# Altium project AutomotiveNetworkEVB.PrjPCB
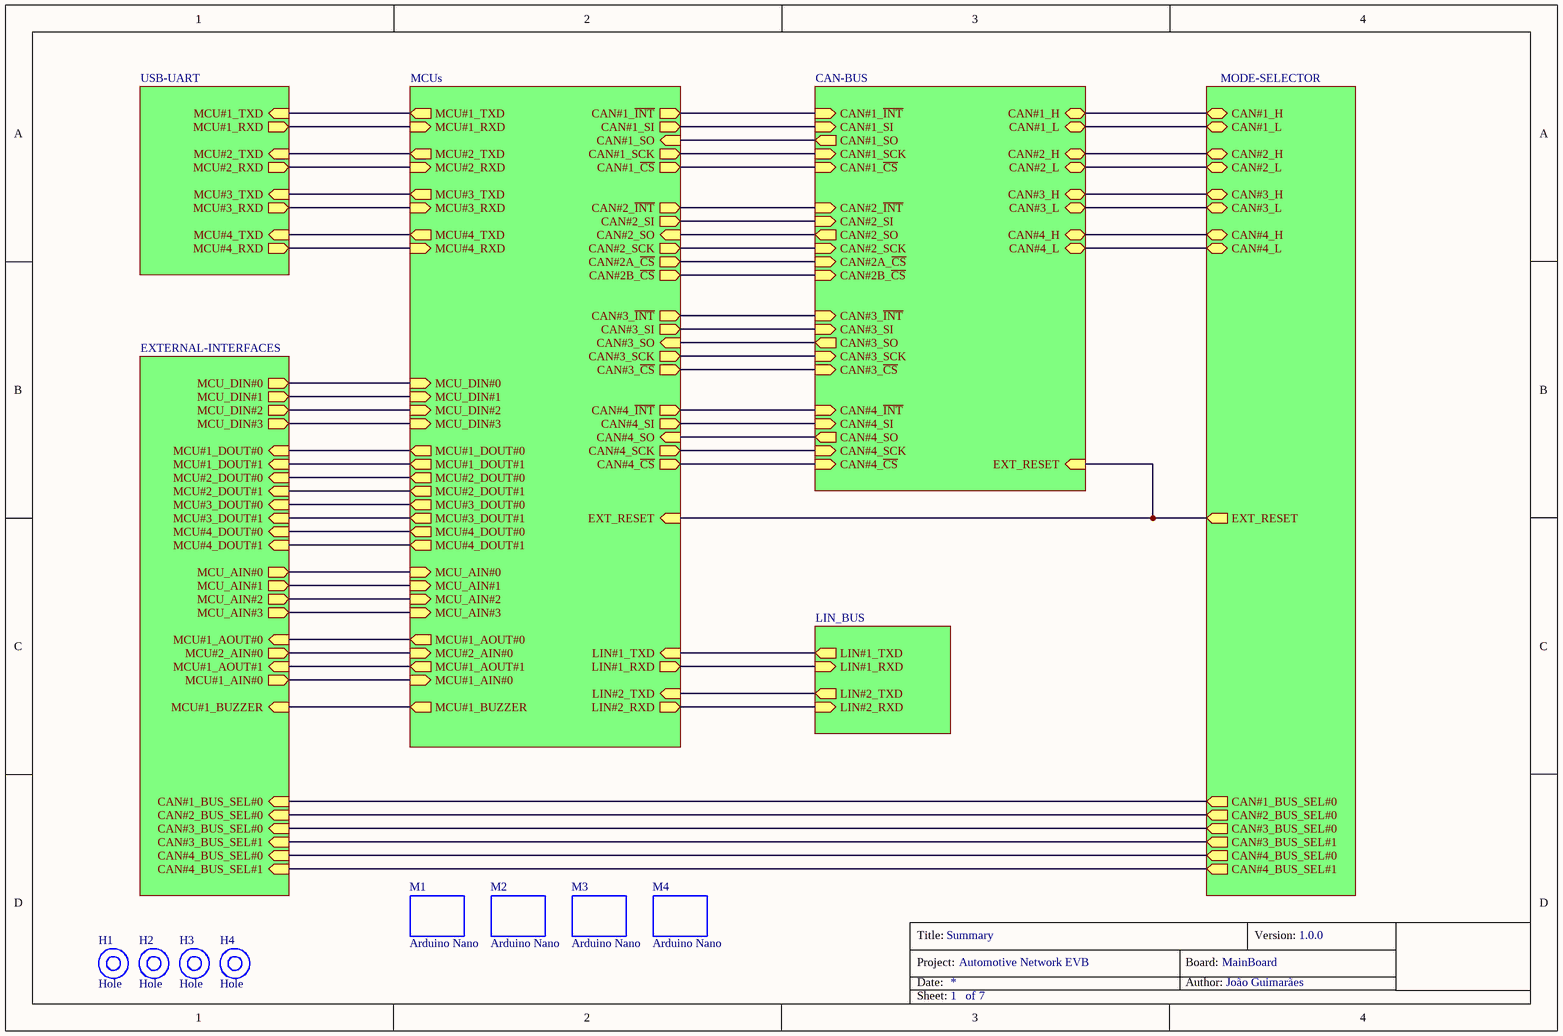
[diagram p0: SUMMARY.SchDoc]
PCB: MainBoard; Project: Automotive Network EVB; ProjectAbrev: ANEVB; Version: 1.0.0
7 sheets, 307 parts. Net scope: hierarchical (ports join the sheet entries above them; power ports are global).
Board file: AutomotiveNetworkEVB.PcbDoc
Sheets:
  SUMMARY.SchDoc
    MCUs = MCUs.SchDoc
    USB-UART = USB-UART.SchDoc
    CAN-BUS = CAN-BUS.SchDoc
    LIN_BUS = LIN-BUS.SchDoc
    EXTERNAL-INTERFACES = EXTERNAL-INTERFACES.SchDoc
    MODE-SELECTOR = MODE-SELECTOR.SchDoc

## Sheet SUMMARY.SchDoc: Summary
size A4; Author: João Guimarães; Revision: 1.0; SheetNumber: 1; SheetTotal: 7; Project: Automotive Network EVB; PCB: MainBoard; Version: 1.0.0

### Parts
H1  Hole  [MISC-HOLE-3.5MM/6.6MM]
H2  Hole  [MISC-HOLE-3.5MM/6.6MM]
H3  Hole  [MISC-HOLE-3.5MM/6.6MM]
H4  Hole  [MISC-HOLE-3.5MM/6.6MM]
M1  Arduino Nano  [MEC-Arduino-Nano]
M2  Arduino Nano  [MEC-Arduino-Nano]
M3  Arduino Nano  [MEC-Arduino-Nano]
M4  Arduino Nano  [MEC-Arduino-Nano]

### Sub-sheets
CAN-BUS = CAN-BUS.SchDoc: CAN#1_~{INT} (in), CAN#1_SI (in), CAN#1_SO (out), CAN#1_SCK (in), CAN#2_~{INT} (in), CAN#2_SI (in), CAN#2_SO (out), CAN#2_SCK (in), CAN#3_~{INT} (in), CAN#2A_~{CS} (in), CAN#2B_~{CS} (in), CAN#3_SI (in), CAN#3_SO (out), CAN#3_SCK (in), CAN#3_~{CS} (in), CAN#4_~{INT} (in), CAN#4_SI (in), CAN#4_SO (out), CAN#4_SCK (in), CAN#4_~{CS} (in), CAN#1_H (bidir), CAN#1_L (bidir), CAN#2_H (bidir), CAN#2_L (bidir), CAN#3_H (bidir), CAN#3_L (bidir), CAN#4_H (bidir), CAN#4_L (bidir), EXT_RESET (in), CAN#1_~{CS} (in)
EXTERNAL-INTERFACES = EXTERNAL-INTERFACES.SchDoc: MCU_DIN#0 (out), MCU#1_DOUT#0 (in), MCU_AIN#0 (out), MCU_DIN#1 (out), MCU_DIN#2 (out), MCU_DIN#3 (out), MCU_AIN#1 (out), MCU_AIN#2 (out), MCU_AIN#3 (out), MCU#1_AOUT#0 (in), MCU#2_AIN#0 (out), MCU#1_AOUT#1 (in), MCU#1_BUZZER (in), MCU#1_DOUT#1 (in), MCU#2_DOUT#0 (in), MCU#2_DOUT#1 (in), MCU#3_DOUT#0 (in), MCU#3_DOUT#1 (in), MCU#4_DOUT#0 (in), MCU#4_DOUT#1 (in), CAN#4_BUS_SEL#1 (in), CAN#4_BUS_SEL#0 (in), CAN#3_BUS_SEL#1 (in), CAN#3_BUS_SEL#0 (in), CAN#2_BUS_SEL#0 (in), CAN#1_BUS_SEL#0 (in), MCU#1_AIN#0 (out)
LIN_BUS = LIN-BUS.SchDoc: LIN#1_TXD (out), LIN#1_RXD (in), LIN#2_TXD (out), LIN#2_RXD (in)
MCUs = MCUs.SchDoc: CAN#1_~{INT} (out), CAN#1_~{CS} (out), CAN#1_SI (out), CAN#1_SO (in), CAN#1_SCK (out), CAN#2_~{INT} (out), CAN#2A_~{CS} (out), CAN#2_SI (out), CAN#2_SO (in), CAN#2_SCK (out), CAN#3_~{INT} (out), CAN#3_~{CS} (out), CAN#3_SI (out), CAN#3_SO (in), CAN#3_SCK (out), CAN#4_~{INT} (out), CAN#4_~{CS} (out), CAN#4_SI (out), CAN#4_SO (in), CAN#4_SCK (out), CAN#2B_~{CS} (out), MCU#1_TXD (out), MCU#1_RXD (in), MCU#2_TXD (out), MCU#3_TXD (out), MCU#4_TXD (out), MCU#2_RXD (in), MCU#3_RXD (in), MCU#4_RXD (in), MCU_DIN#0 (in), MCU_DIN#1 (in), MCU_DIN#2 (in), MCU_DIN#3 (in), LIN#1_TXD (in), LIN#1_RXD (out), LIN#2_TXD (in), LIN#2_RXD (out), MCU#1_DOUT#0 (out), MCU#1_DOUT#1 (out), MCU#2_DOUT#0 (out), MCU#2_DOUT#1 (out), MCU#3_DOUT#0 (out), MCU#3_DOUT#1 (out), MCU#4_DOUT#0 (out), MCU#4_DOUT#1 (out), MCU_AIN#0 (in), MCU_AIN#1 (in), MCU_AIN#2 (in), MCU_AIN#3 (in), MCU#1_AOUT#0 (out), MCU#2_AIN#0 (in), MCU#1_AOUT#1 (out), MCU#1_AIN#0 (in), MCU#1_BUZZER (out), EXT_RESET (in)
MODE-SELECTOR = MODE-SELECTOR.SchDoc: CAN#1_H (bidir), CAN#1_L (bidir), CAN#2_H (bidir), CAN#2_L (bidir), CAN#3_H (bidir), CAN#3_L (bidir), CAN#4_H (bidir), CAN#4_L (bidir), CAN#4_BUS_SEL#1 (out), CAN#4_BUS_SEL#0 (out), CAN#3_BUS_SEL#1 (out), CAN#3_BUS_SEL#0 (out), CAN#2_BUS_SEL#0 (out), CAN#1_BUS_SEL#0 (out), EXT_RESET (out)
USB-UART = USB-UART.SchDoc: MCU#1_TXD (in), MCU#1_RXD (out), MCU#2_TXD (in), MCU#2_RXD (out), MCU#3_TXD (in), MCU#3_RXD (out), MCU#4_TXD (in), MCU#4_RXD (out)

### Nets
CAN#1_H: sheet CAN-BUS/CAN#1_H, sheet MODE-SELECTOR/CAN#1_H
CAN#1_L: sheet CAN-BUS/CAN#1_L, sheet MODE-SELECTOR/CAN#1_L
CAN#2_H: sheet CAN-BUS/CAN#2_H, sheet MODE-SELECTOR/CAN#2_H
CAN#2_~{INT}: sheet MCUs/CAN#2_~{INT}, sheet CAN-BUS/CAN#2_~{INT}
CAN#2_L: sheet CAN-BUS/CAN#2_L, sheet MODE-SELECTOR/CAN#2_L
CAN#2_SCK: sheet MCUs/CAN#2_SCK, sheet CAN-BUS/CAN#2_SCK
CAN#2_SI: sheet MCUs/CAN#2_SI, sheet CAN-BUS/CAN#2_SI
CAN#2_SO: sheet MCUs/CAN#2_SO, sheet CAN-BUS/CAN#2_SO
CAN#3_H: sheet CAN-BUS/CAN#3_H, sheet MODE-SELECTOR/CAN#3_H
CAN#3_L: sheet CAN-BUS/CAN#3_L, sheet MODE-SELECTOR/CAN#3_L
CAN#4_H: sheet CAN-BUS/CAN#4_H, sheet MODE-SELECTOR/CAN#4_H
CAN#4_L: sheet CAN-BUS/CAN#4_L, sheet MODE-SELECTOR/CAN#4_L
EXT_RESET: sheet MCUs/EXT_RESET, sheet CAN-BUS/EXT_RESET, sheet MODE-SELECTOR/EXT_RESET
MCU_AIN#0: sheet MCUs/MCU_AIN#0, sheet EXTERNAL-INTERFACES/MCU_AIN#0
MCU_AIN#1: sheet MCUs/MCU_AIN#1, sheet EXTERNAL-INTERFACES/MCU_AIN#1
MCU_AIN#2: sheet MCUs/MCU_AIN#2, sheet EXTERNAL-INTERFACES/MCU_AIN#2
MCU_AIN#3: sheet MCUs/MCU_AIN#3, sheet EXTERNAL-INTERFACES/MCU_AIN#3
MCU_DIN#0: sheet MCUs/MCU_DIN#0, sheet EXTERNAL-INTERFACES/MCU_DIN#0
MCU_DIN#1: sheet MCUs/MCU_DIN#1, sheet EXTERNAL-INTERFACES/MCU_DIN#1
MCU_DIN#2: sheet MCUs/MCU_DIN#2, sheet EXTERNAL-INTERFACES/MCU_DIN#2
MCU_DIN#3: sheet MCUs/MCU_DIN#3, sheet EXTERNAL-INTERFACES/MCU_DIN#3
NetC23_1: sheet MCUs/MCU#2_AIN#0, sheet EXTERNAL-INTERFACES/MCU#2_AIN#0
NetCON3_1: sheet MCUs/MCU#1_TXD, sheet USB-UART/MCU#1_TXD
NetCON3_2: sheet MCUs/MCU#1_RXD, sheet USB-UART/MCU#1_RXD
NetCON3_5: sheet MCUs/CAN#1_~{INT}, sheet CAN-BUS/CAN#1_~{INT}
NetCON3_6: sheet MCUs/MCU#1_DOUT#0, sheet EXTERNAL-INTERFACES/MCU#1_DOUT#0
NetCON3_7: sheet MCUs/MCU#1_DOUT#1, sheet EXTERNAL-INTERFACES/MCU#1_DOUT#1
NetCON3_8: sheet MCUs/MCU#1_AOUT#0, sheet EXTERNAL-INTERFACES/MCU#1_AOUT#0
NetCON3_9: sheet MCUs/MCU#1_AOUT#1, sheet EXTERNAL-INTERFACES/MCU#1_AOUT#1
NetCON3_10: sheet MCUs/MCU#1_BUZZER, sheet EXTERNAL-INTERFACES/MCU#1_BUZZER
NetCON3_13: sheet MCUs/CAN#1_~{CS}, sheet CAN-BUS/CAN#1_~{CS}
NetCON3_14: sheet MCUs/CAN#1_SI, sheet CAN-BUS/CAN#1_SI
NetCON3_15: sheet MCUs/CAN#1_SO, sheet CAN-BUS/CAN#1_SO
NetCON3_16: sheet MCUs/CAN#1_SCK, sheet CAN-BUS/CAN#1_SCK
NetCON3_25: sheet MCUs/MCU#1_AIN#0, sheet EXTERNAL-INTERFACES/MCU#1_AIN#0
NetCON4_1: sheet MCUs/MCU#2_TXD, sheet USB-UART/MCU#2_TXD
NetCON4_2: sheet MCUs/MCU#2_RXD, sheet USB-UART/MCU#2_RXD
NetCON4_6: sheet MCUs/MCU#2_DOUT#0, sheet EXTERNAL-INTERFACES/MCU#2_DOUT#0
NetCON4_7: sheet MCUs/MCU#2_DOUT#1, sheet EXTERNAL-INTERFACES/MCU#2_DOUT#1
NetCON4_9: sheet MCUs/CAN#2B_~{CS}, sheet CAN-BUS/CAN#2B_~{CS}
NetCON4_13: sheet MCUs/CAN#2A_~{CS}, sheet CAN-BUS/CAN#2A_~{CS}
NetCON5_1: sheet MCUs/MCU#3_TXD, sheet USB-UART/MCU#3_TXD
NetCON5_2: sheet MCUs/MCU#3_RXD, sheet USB-UART/MCU#3_RXD
NetCON5_5: sheet MCUs/CAN#3_~{INT}, sheet CAN-BUS/CAN#3_~{INT}
NetCON5_6: sheet MCUs/MCU#3_DOUT#0, sheet EXTERNAL-INTERFACES/MCU#3_DOUT#0
NetCON5_7: sheet MCUs/MCU#3_DOUT#1, sheet EXTERNAL-INTERFACES/MCU#3_DOUT#1
NetCON5_8: sheet MCUs/LIN#1_TXD, sheet LIN_BUS/LIN#1_TXD
NetCON5_9: sheet MCUs/LIN#1_RXD, sheet LIN_BUS/LIN#1_RXD
NetCON5_13: sheet MCUs/CAN#3_~{CS}, sheet CAN-BUS/CAN#3_~{CS}
NetCON5_14: sheet MCUs/CAN#3_SI, sheet CAN-BUS/CAN#3_SI
NetCON5_15: sheet MCUs/CAN#3_SO, sheet CAN-BUS/CAN#3_SO
NetCON5_16: sheet MCUs/CAN#3_SCK, sheet CAN-BUS/CAN#3_SCK
NetCON6_1: sheet MCUs/MCU#4_TXD, sheet USB-UART/MCU#4_TXD
NetCON6_2: sheet MCUs/MCU#4_RXD, sheet USB-UART/MCU#4_RXD
NetCON6_5: sheet MCUs/CAN#4_~{INT}, sheet CAN-BUS/CAN#4_~{INT}
NetCON6_6: sheet MCUs/MCU#4_DOUT#0, sheet EXTERNAL-INTERFACES/MCU#4_DOUT#0
NetCON6_7: sheet MCUs/MCU#4_DOUT#1, sheet EXTERNAL-INTERFACES/MCU#4_DOUT#1
NetCON6_8: sheet MCUs/LIN#2_TXD, sheet LIN_BUS/LIN#2_TXD
NetCON6_9: sheet MCUs/LIN#2_RXD, sheet LIN_BUS/LIN#2_RXD
NetCON6_13: sheet MCUs/CAN#4_~{CS}, sheet CAN-BUS/CAN#4_~{CS}
NetCON6_14: sheet MCUs/CAN#4_SI, sheet CAN-BUS/CAN#4_SI
NetCON6_15: sheet MCUs/CAN#4_SO, sheet CAN-BUS/CAN#4_SO
NetCON6_16: sheet MCUs/CAN#4_SCK, sheet CAN-BUS/CAN#4_SCK
NetQ1_1: sheet EXTERNAL-INTERFACES/CAN#2_BUS_SEL#0, sheet MODE-SELECTOR/CAN#2_BUS_SEL#0
NetQ2_1: sheet EXTERNAL-INTERFACES/CAN#1_BUS_SEL#0, sheet MODE-SELECTOR/CAN#1_BUS_SEL#0
NetQ12_1: sheet EXTERNAL-INTERFACES/CAN#3_BUS_SEL#0, sheet MODE-SELECTOR/CAN#3_BUS_SEL#0
NetQ13_1: sheet EXTERNAL-INTERFACES/CAN#3_BUS_SEL#1, sheet MODE-SELECTOR/CAN#3_BUS_SEL#1
NetQ14_1: sheet EXTERNAL-INTERFACES/CAN#4_BUS_SEL#0, sheet MODE-SELECTOR/CAN#4_BUS_SEL#0
NetQ15_1: sheet EXTERNAL-INTERFACES/CAN#4_BUS_SEL#1, sheet MODE-SELECTOR/CAN#4_BUS_SEL#1

### Notes on the sheet
- Title:
- Project:
- Date:
- Author:
- Board:
- Version:
- Sheet:
- of

### Library data of the parts
M1-M4 = Arduino Nano Mechanical

## Sheet MCUs.SchDoc: MCUs
size A4; Author: João Guimarães; Organization: Altium Limited; Address1: L3, 12a Rodborough Rd; Address2: Frenchs Forest; Address3: NSW; Address4: Australia 2086; SheetNumber: 3; SheetTotal: 7; Version: 1.0.0; Project: Automotive Network EVB; PCB: MainBoard
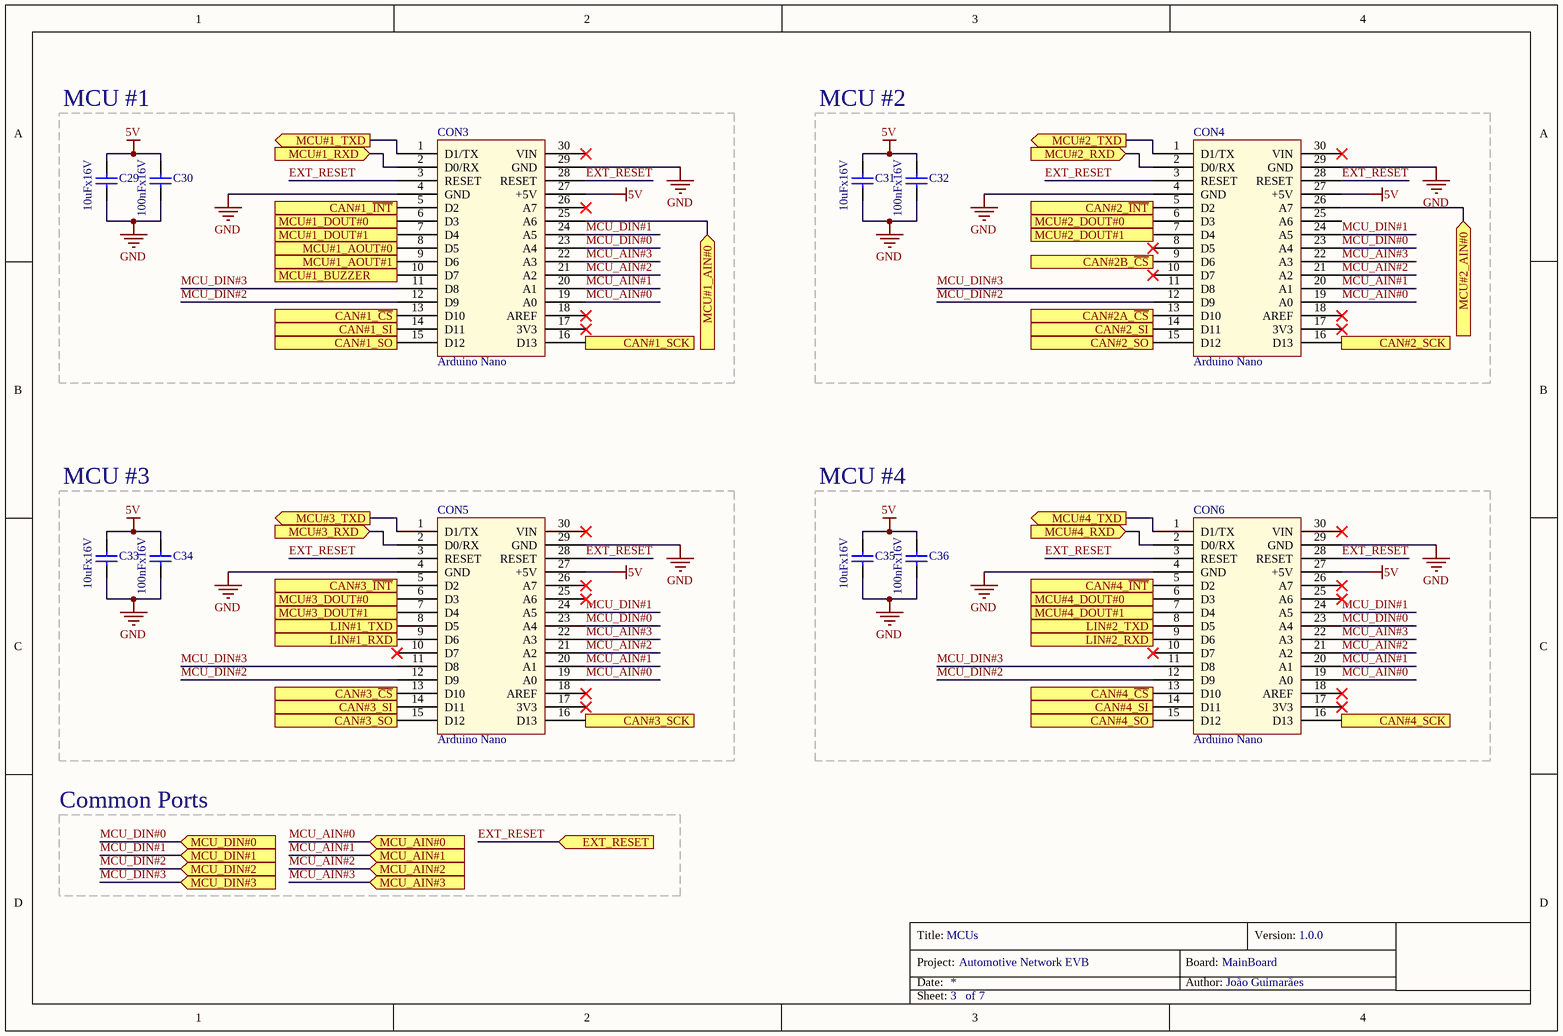
[diagram p1: MCUs.SchDoc]

### Parts
C29  10uFx16V  [DISC-0805]
C30  100nFx16V  [DISC-0603]
C31  10uFx16V  [DISC-0805]
C32  100nFx16V  [DISC-0603]
C33  10uFx16V  [DISC-0805]
C34  100nFx16V  [DISC-0603]
C35  10uFx16V  [DISC-0805]
C36  100nFx16V  [DISC-0603]
CON3  Arduino Nano  [MOD-ARDUINO-NANO]
CON4  Arduino Nano  [MOD-ARDUINO-NANO]
CON5  Arduino Nano  [MOD-ARDUINO-NANO]
CON6  Arduino Nano  [MOD-ARDUINO-NANO]

### Blocks framed on the sheet
MCU #1: C29 C30 CON3
MCU #2: C31 C32 CON4
MCU #3: C33 C34 CON5
MCU #4: C35 C36 CON6

### Ports
CAN#1_SCK (out), CAN#1_SI (out), CAN#1_SO (in), CAN#1_~{CS} (out), CAN#1_~{INT} (out), CAN#2_SCK (out), CAN#2_SI (out), CAN#2_SO (in), CAN#2_~{INT} (out), CAN#2A_~{CS} (out), CAN#2B_~{CS} (out), CAN#3_SCK (out), CAN#3_SI (out), CAN#3_SO (in), CAN#3_~{CS} (out), CAN#3_~{INT} (out), CAN#4_SCK (out), CAN#4_SI (out), CAN#4_SO (in), CAN#4_~{CS} (out), CAN#4_~{INT} (out), EXT_RESET (in), LIN#1_RXD (out), LIN#1_TXD (in), LIN#2_RXD (out), LIN#2_TXD (in), MCU#1_AIN#0 (in), MCU#1_AOUT#0 (out), MCU#1_AOUT#1 (out), MCU#1_BUZZER (out), MCU#1_DOUT#0 (out), MCU#1_DOUT#1 (out), MCU#1_RXD (in), MCU#1_TXD (out), MCU#2_AIN#0 (in), MCU#2_DOUT#0 (out), MCU#2_DOUT#1 (out), MCU#2_RXD (in), MCU#2_TXD (out), MCU#3_DOUT#0 (out), MCU#3_DOUT#1 (out), MCU#3_RXD (in), MCU#3_TXD (out), MCU#4_DOUT#0 (out), MCU#4_DOUT#1 (out), MCU#4_RXD (in), MCU#4_TXD (out), MCU_AIN#0 (in), MCU_AIN#1 (in), MCU_AIN#2 (in), MCU_AIN#3 (in), MCU_DIN#0 (in), MCU_DIN#1 (in), MCU_DIN#2 (in), MCU_DIN#3 (in)

### Nets
5V: C29.1 C30.1 C31.1 C32.1 C33.1 C34.1 C35.1 C36.1 CON3.27(+5V) CON4.27(+5V) CON5.27(+5V) CON6.27(+5V)
GND: C29.2 C30.2 C31.2 C32.2 C33.2 C34.2 C35.2 C36.2 CON3.4(GND) CON3.29(GND) CON4.4(GND) CON4.29(GND) CON5.4(GND) CON5.29(GND) CON6.4(GND) CON6.29(GND)
CAN#2_~{INT}: CON4.5(D2) ; port CAN#2_~{INT}
CAN#2_SCK: CON4.16(D13) ; port CAN#2_SCK
CAN#2_SI: CON4.14(D11) ; port CAN#2_SI
CAN#2_SO: CON4.15(D12) ; port CAN#2_SO
EXT_RESET: CON3.3(RESET) CON3.28(RESET) CON4.3(RESET) CON4.28(RESET) CON5.3(RESET) CON5.28(RESET) CON6.3(RESET) CON6.28(RESET) ; port EXT_RESET
MCU_AIN#0: CON3.19(A0) CON4.19(A0) CON5.19(A0) CON6.19(A0) ; port MCU_AIN#0
MCU_AIN#1: CON3.20(A1) CON4.20(A1) CON5.20(A1) CON6.20(A1) ; port MCU_AIN#1
MCU_AIN#2: CON3.21(A2) CON4.21(A2) CON5.21(A2) CON6.21(A2) ; port MCU_AIN#2
MCU_AIN#3: CON3.22(A3) CON4.22(A3) CON5.22(A3) CON6.22(A3) ; port MCU_AIN#3
MCU_DIN#0: CON3.23(A4) CON4.23(A4) CON5.23(A4) CON6.23(A4) ; port MCU_DIN#0
MCU_DIN#1: CON3.24(A5) CON4.24(A5) CON5.24(A5) CON6.24(A5) ; port MCU_DIN#1
MCU_DIN#2: CON3.12(D9) CON4.12(D9) CON5.12(D9) CON6.12(D9) ; port MCU_DIN#2
MCU_DIN#3: CON3.11(D8) CON4.11(D8) CON5.11(D8) CON6.11(D8) ; port MCU_DIN#3
NetC23_1: CON4.26(A7) ; port MCU#2_AIN#0
NetCON3_1: CON3.1(D1/TX) ; port MCU#1_TXD
NetCON3_2: CON3.2(D0/RX) ; port MCU#1_RXD
NetCON3_5: CON3.5(D2) ; port CAN#1_~{INT}
NetCON3_6: CON3.6(D3) ; port MCU#1_DOUT#0
NetCON3_7: CON3.7(D4) ; port MCU#1_DOUT#1
NetCON3_8: CON3.8(D5) ; port MCU#1_AOUT#0
NetCON3_9: CON3.9(D6) ; port MCU#1_AOUT#1
NetCON3_10: CON3.10(D7) ; port MCU#1_BUZZER
NetCON3_13: CON3.13(D10) ; port CAN#1_~{CS}
NetCON3_14: CON3.14(D11) ; port CAN#1_SI
NetCON3_15: CON3.15(D12) ; port CAN#1_SO
NetCON3_16: CON3.16(D13) ; port CAN#1_SCK
NetCON3_25: CON3.25(A6) ; port MCU#1_AIN#0
NetCON4_1: CON4.1(D1/TX) ; port MCU#2_TXD
NetCON4_2: CON4.2(D0/RX) ; port MCU#2_RXD
NetCON4_6: CON4.6(D3) ; port MCU#2_DOUT#0
NetCON4_7: CON4.7(D4) ; port MCU#2_DOUT#1
NetCON4_9: CON4.9(D6) ; port CAN#2B_~{CS}
NetCON4_13: CON4.13(D10) ; port CAN#2A_~{CS}
NetCON5_1: CON5.1(D1/TX) ; port MCU#3_TXD
NetCON5_2: CON5.2(D0/RX) ; port MCU#3_RXD
NetCON5_5: CON5.5(D2) ; port CAN#3_~{INT}
NetCON5_6: CON5.6(D3) ; port MCU#3_DOUT#0
NetCON5_7: CON5.7(D4) ; port MCU#3_DOUT#1
NetCON5_8: CON5.8(D5) ; port LIN#1_TXD
NetCON5_9: CON5.9(D6) ; port LIN#1_RXD
NetCON5_13: CON5.13(D10) ; port CAN#3_~{CS}
NetCON5_14: CON5.14(D11) ; port CAN#3_SI
NetCON5_15: CON5.15(D12) ; port CAN#3_SO
NetCON5_16: CON5.16(D13) ; port CAN#3_SCK
NetCON6_1: CON6.1(D1/TX) ; port MCU#4_TXD
NetCON6_2: CON6.2(D0/RX) ; port MCU#4_RXD
NetCON6_5: CON6.5(D2) ; port CAN#4_~{INT}
NetCON6_6: CON6.6(D3) ; port MCU#4_DOUT#0
NetCON6_7: CON6.7(D4) ; port MCU#4_DOUT#1
NetCON6_8: CON6.8(D5) ; port LIN#2_TXD
NetCON6_9: CON6.9(D6) ; port LIN#2_RXD
NetCON6_13: CON6.13(D10) ; port CAN#4_~{CS}
NetCON6_14: CON6.14(D11) ; port CAN#4_SI
NetCON6_15: CON6.15(D12) ; port CAN#4_SO
NetCON6_16: CON6.16(D13) ; port CAN#4_SCK

Not connected (* = marked no-connect by the designer): CON3 17(3V3)* 18(AREF)* 26(A7)* 30(VIN)*; CON4 8(D5)* 10(D7)* 17(3V3)* 18(AREF)* 25(A6) 30(VIN)*; CON5 10(D7)* 17(3V3)* 18(AREF)* 25(A6)* 26(A7)* 30(VIN)*; CON6 10(D7)* 17(3V3)* 18(AREF)* 25(A6)* 26(A7)* 30(VIN)*

### Notes on the sheet
- Common Ports
- Title:
- Project:
- Date:
- Author:
- Board:
- Version:
- Sheet:
- of

### Library data of the parts
C29 C31 C33 C35 = Cap: Capacitor; PartNumber1: EMK212ABJ106MG-T; Manufacturer1: TaiyoYuden; ClassName: Mcu
C30 C32 C34 C36 = Cap: Capacitor; PartNumber1: C0603C104Z3VACTU; Manufacturer1: Kemet; ClassName: Mcu
CON3-CON6 = Arduino Nano: ClassName: Mcu

## Sheet USB-UART.SchDoc: USB-UART
size A4; Author: João Guimarães; Organization: Altium Limited; Address1: L3, 12a Rodborough Rd; Address2: Frenchs Forest; Address3: NSW; Address4: Australia 2086; SheetNumber: 2; SheetTotal: 7; Version: 1.0.0; PCB: MainBoard; Project: Automotive Network EVB
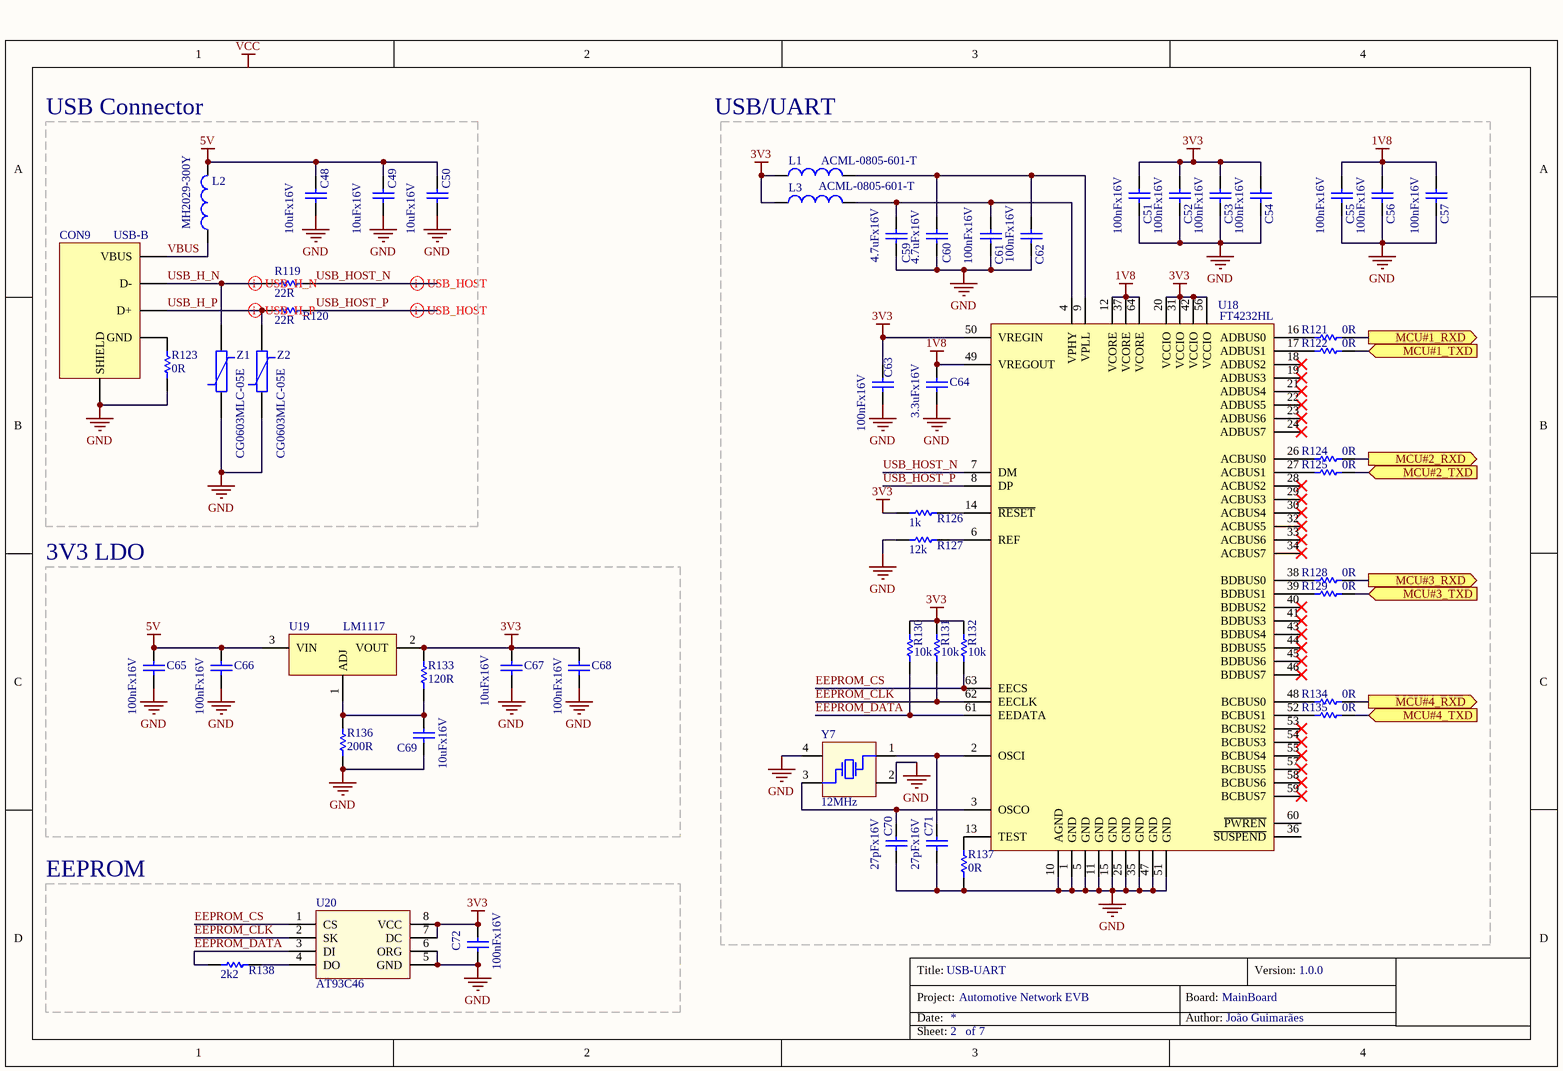
[diagram p2: USB-UART.SchDoc]

### Parts
C48  10uFx16V  [DISC-0805]
C49  10uFx16V  [DISC-0805]
C50  10uFx16V  [DISC-0805]
C51  100nFx16V  [DISC-0603]
C52  100nFx16V  [DISC-0603]
C53  100nFx16V  [DISC-0603]
C54  100nFx16V  [DISC-0603]
C55  100nFx16V  [DISC-0603]
C56  100nFx16V  [DISC-0603]
C57  100nFx16V  [DISC-0603]
C59  4.7uFx16V  [DISC-0805]
C60  4.7uFx16V  [DISC-0805]
C61  100nFx16V  [DISC-0603]
C62  100nFx16V  [DISC-0603]
C63  100nFx16V  [DISC-0603]
C64  3.3uFx16V  [DISC-0603]
C65  100nFx16V  [DISC-0603]
C66  100nFx16V  [DISC-0603]
C67  10uFx16V  [DISC-0805]
C68  100nFx16V  [DISC-0603]
C69  10uFx16V  [DISC-0805]
C70  27pFx16V  [DISC-0603]
C71  27pFx16V  [DISC-0603]
C72  100nFx16V  [DISC-0603]
CON9  USB-B  [CON-USB-B]
L1  ACML-0805-601-T  [DISC-0805]
L2  MH2029-300Y  [DISC-0805]
L3  ACML-0805-601-T  [DISC-0805]
R119  22R  [DISC-0603]
R120  22R  [DISC-0603]
R121  0R  [DISC-0603]
R122  0R  [DISC-0603]
R123  0R  [DISC-0603]
R124  0R  [DISC-0603]
R125  0R  [DISC-0603]
R126  1k  [DISC-0603]
R127  12k  [DISC-0603]
R128  0R  [DISC-0603]
R129  0R  [DISC-0603]
R130  10k  [DISC-0603]
R131  10k  [DISC-0603]
R132  10k  [DISC-0603]
R133  120R  [DISC-0603]
R134  0R  [DISC-0603]
R135  0R  [DISC-0603]
R136  200R  [DISC-0603]
R137  0R  [DISC-0603]
R138  2k2  [DISC-0603]
U18  FT4232HL  [CI-LQFP-64]
U19  LM1117  [DISC-SOT-223]
U20  AT93C46  [CI-SOIC-8]
Y7  12MHz  [DISC-CRYSTAL-4P-7X5]
Z1  CG0603MLC-05E  [DISC-0603]
Z2  CG0603MLC-05E  [DISC-0603]

### Blocks framed on the sheet
USB Connector: C48-C50 CON9 L2 R119 R120 R123 Z1 Z2
3V3 LDO: C65-C69 R133 R136 U19
EEPROM: C72 R138 U20

### Ports
MCU#1_RXD (out), MCU#1_TXD (in), MCU#2_RXD (out), MCU#2_TXD (in), MCU#3_RXD (out), MCU#3_TXD (in), MCU#4_RXD (out), MCU#4_TXD (in)

### Nets
1V8: C55.1 C56.1 C57.1 C64.1 U18.12(VCORE) U18.37(VCORE) U18.49(VREGOUT) U18.64(VCORE)
3V3: C51.1 C52.1 C53.1 C54.1 C63.1 C67.1 C68.1 C72.1 L1.1 L3.1 R126.1 R130.2 R131.2 R132.2 R133.2 U18.20(VCCIO) U18.31(VCCIO) U18.42(VCCIO) U18.50(VREGIN) U18.56(VCCIO) U19.2(VOUT) U19.4(VOUT) U20.7(DC) U20.8(VCC)
5V: C48.1 C49.1 C50.1 C65.1 C66.1 L2.2 U19.3(VIN)
GND: C48.2 C49.2 C50.2 C51.2 C52.2 C53.2 C54.2 C55.2 C56.2 C57.2 C59.2 C60.2 C61.2 C62.2 C63.2 C64.2 C65.2 C66.2 C67.2 C68.2 C69.2 C70.1 C71.1 C72.2 CON9.5(SHIELD) CON9.6(SHIELD) R123.1 R127.1 R136.1 R137.1 U18.1(GND) U18.5(GND) U18.10(AGND) U18.11(GND) U18.15(GND) U18.25(GND) U18.35(GND) U18.47(GND) U18.51(GND) U20.5(GND) U20.6(ORG) Y7.2(GND) Y7.4(GND) Z1.1 Z2.1
EEPROM_CLK: R131.1 U18.62(EECLK) U20.2(SK)
EEPROM_CS: R132.1 U18.63(EECS) U20.1(CS)
EEPROM_DATA: R130.1 R138.1 U18.61(EEDATA) U20.3(DI)
USB_H_N: CON9.2(D-) R119.1 Z1.2
USB_H_P: CON9.3(D+) R120.1 Z2.2
USB_HOST_N: R119.2 U18.7(DM)
USB_HOST_P: R120.2 U18.8(DP)
VBUS: CON9.1(VBUS) L2.1
NetC59_1: C59.1 C61.1 L3.2 U18.4(VPHY)
NetC60_1: C60.1 C62.1 L1.2 U18.9(VPLL)
NetC69_1: C69.1 R133.1 R136.2 U19.1(ADJ)
NetC70_2: C70.2 U18.3(OSCO) Y7.3(OSC2)
NetC71_2: C71.2 U18.2(OSCI) Y7.1(OSC1)
NetCON3_1: R122.2 ; port MCU#1_TXD
NetCON3_2: R121.2 ; port MCU#1_RXD
NetCON4_1: R125.2 ; port MCU#2_TXD
NetCON4_2: R124.2 ; port MCU#2_RXD
NetCON5_1: R129.2 ; port MCU#3_TXD
NetCON5_2: R128.2 ; port MCU#3_RXD
NetCON6_1: R135.2 ; port MCU#4_TXD
NetCON6_2: R134.2 ; port MCU#4_RXD
NetCON9_4: CON9.4(GND) R123.2
NetR121_1: R121.1 U18.16(ADBUS0)
NetR122_1: R122.1 U18.17(ADBUS1)
NetR124_1: R124.1 U18.26(ACBUS0)
NetR125_1: R125.1 U18.27(ACBUS1)
NetR126_2: R126.2 U18.14(~{RESET})
NetR127_2: R127.2 U18.6(REF)
NetR128_1: R128.1 U18.38(BDBUS0)
NetR129_1: R129.1 U18.39(BDBUS1)
NetR134_1: R134.1 U18.48(BCBUS0)
NetR135_1: R135.1 U18.52(BCBUS1)
NetR137_2: R137.2 U18.13(TEST)
NetR138_2: R138.2 U20.4(DO)

Not connected (* = marked no-connect by the designer): U18 18(ADBUS2)* 19(ADBUS3)* 21(ADBUS4)* 22(ADBUS5)* 23(ADBUS6)* 24(ADBUS7)* 28(ACBUS2)* 29(ACBUS3)* 30(ACBUS4)* 32(ACBUS5)* 33(ACBUS6)* 34(ACBUS7)* 36(~{SUSPEND}) 40(BDBUS2)* 41(BDBUS3)* 43(BDBUS4)* 44(BDBUS5)* 45(BDBUS6)* 46(BDBUS7)* 53(BCBUS2)* 54(BCBUS3)* 55(BCBUS4)* 57(BCBUS5)* 58(BCBUS6)* 59(BCBUS7)* 60(~{PWREN})

### Layout directives
differential pair; net class USBDIF: USB_H_N, USB_H_P, USB_HOST_N, USB_HOST_P

### Notes on the sheet
- USB/UART
- Labels drawn without touching a wire or pin: VCC
- Title:
- Project:
- Date:
- Author:
- Board:
- Version:
- Sheet:
- of

### Library data of the parts
C48-C50 C67 C69 = Cap: as C29 on sheet MCUs; ClassName: UsbUart
C51-C57 C61-C63 C65 C66 C68 C72 = Cap: as C30 on sheet MCUs; ClassName: UsbUart
C59 C60 = Cap: Capacitor; PartNumber1: 0805X475M250CT; Manufacturer1: Walsin; ClassName: UsbUart
C64 = Cap: Capacitor; PartNumber1: C1608X5R1C335K080AC; Manufacturer1: TDK; ClassName: UsbUart
C70 C71 = Cap: Capacitor; PartNumber1: C0805C270J3HACTU; Manufacturer1: Kemet; ClassName: UsbUart
CON9 = USB Type-B: PartNumber1: UJ2-BH-1-TH; Manufacturer1: CUI; ClassName: UsbUart
L1 L3 = Inductor: Chip Inductor; Manufacturer1: Abracon; ClassName: UsbUart; PartNumber1: ACML-0805-601-T
L2 = Inductor: Chip Inductor; Manufacturer1: Bourns; ClassName: UsbUart; PartNumber1: MH2029-300Y
R119 R120 = Res: Resistor; PartNumber1: RC0603FR-0722RL; Manufacturer1: Yageo; ClassName: UsbUart
R121-R125 R128 R129 R134 R135 R137 = Res: Resistor; PartNumber1: RC0603JR-070RL; Manufacturer1: Yageo; ClassName: UsbUart
R126 = Res: Resistor; PartNumber1: RC0603FR-071KL; Manufacturer1: Yageo; ClassName: UsbUart
R127 = Res: Resistor; PartNumber1: RC0603FR-0712KL; Manufacturer1: Yageo; ClassName: UsbUart
R130-R132 = Res: Resistor; PartNumber1: RC0603FR-0710KL; Manufacturer1: Yageo; ClassName: UsbUart
R133 = Res: Resistor; PartNumber1: RC0603FR-07120RL; Manufacturer1: Yageo; ClassName: UsbUart
R136 = Res: Resistor; PartNumber1: RC0603FR-07200RL; Manufacturer1: Yageo; ClassName: UsbUart
R138 = Res: Resistor; PartNumber1: RC0603FR-072K2L; Manufacturer1: Yageo; ClassName: UsbUart
U18 = FT4232HL: Quad High Speed USB to Multipurpose UART/MPSSE; Manufacturer1: FTDI; ClassName: UsbUart; PartNumber1: FT4232HL
U19 = LM317-N: Wide Temperature Three-Pin Adjustable Regulator; PartNumber1: LM1117-N; Manufacturer1: Texas Instruments; ClassName: UsbUart
U20 = AT93C46: 3-wire Serial EEPROMs; PartNumber1: AT93C46DN-SH-T; Manufacturer1: Microchip; ClassName: UsbUart
Y7 = XTAL-4-PIN: ABMM-12.000MHZ-B2-T; Manufacturer1: Abracon; ClassName: UsbUart; PartNumber1: ABMM-12.000MHZ-B2-T
Z1 Z2 = Varistor: Manufacturer1: Bourns; ClassName: UsbUart; PartNumber1: CG0603MLC-05E

## Sheet CAN-BUS.SchDoc: CAN Interfaces
size A3; Author: João Guimarães; Organization: Altium Limited; Address1: L3, 12a Rodborough Rd; Address2: Frenchs Forest; Address3: NSW; Address4: Australia 2086; Revision: 1.0; SheetNumber: 4; SheetTotal: 7; Version: 1.0.0; PCB: MainBoard; Project: Automotive Network EVB
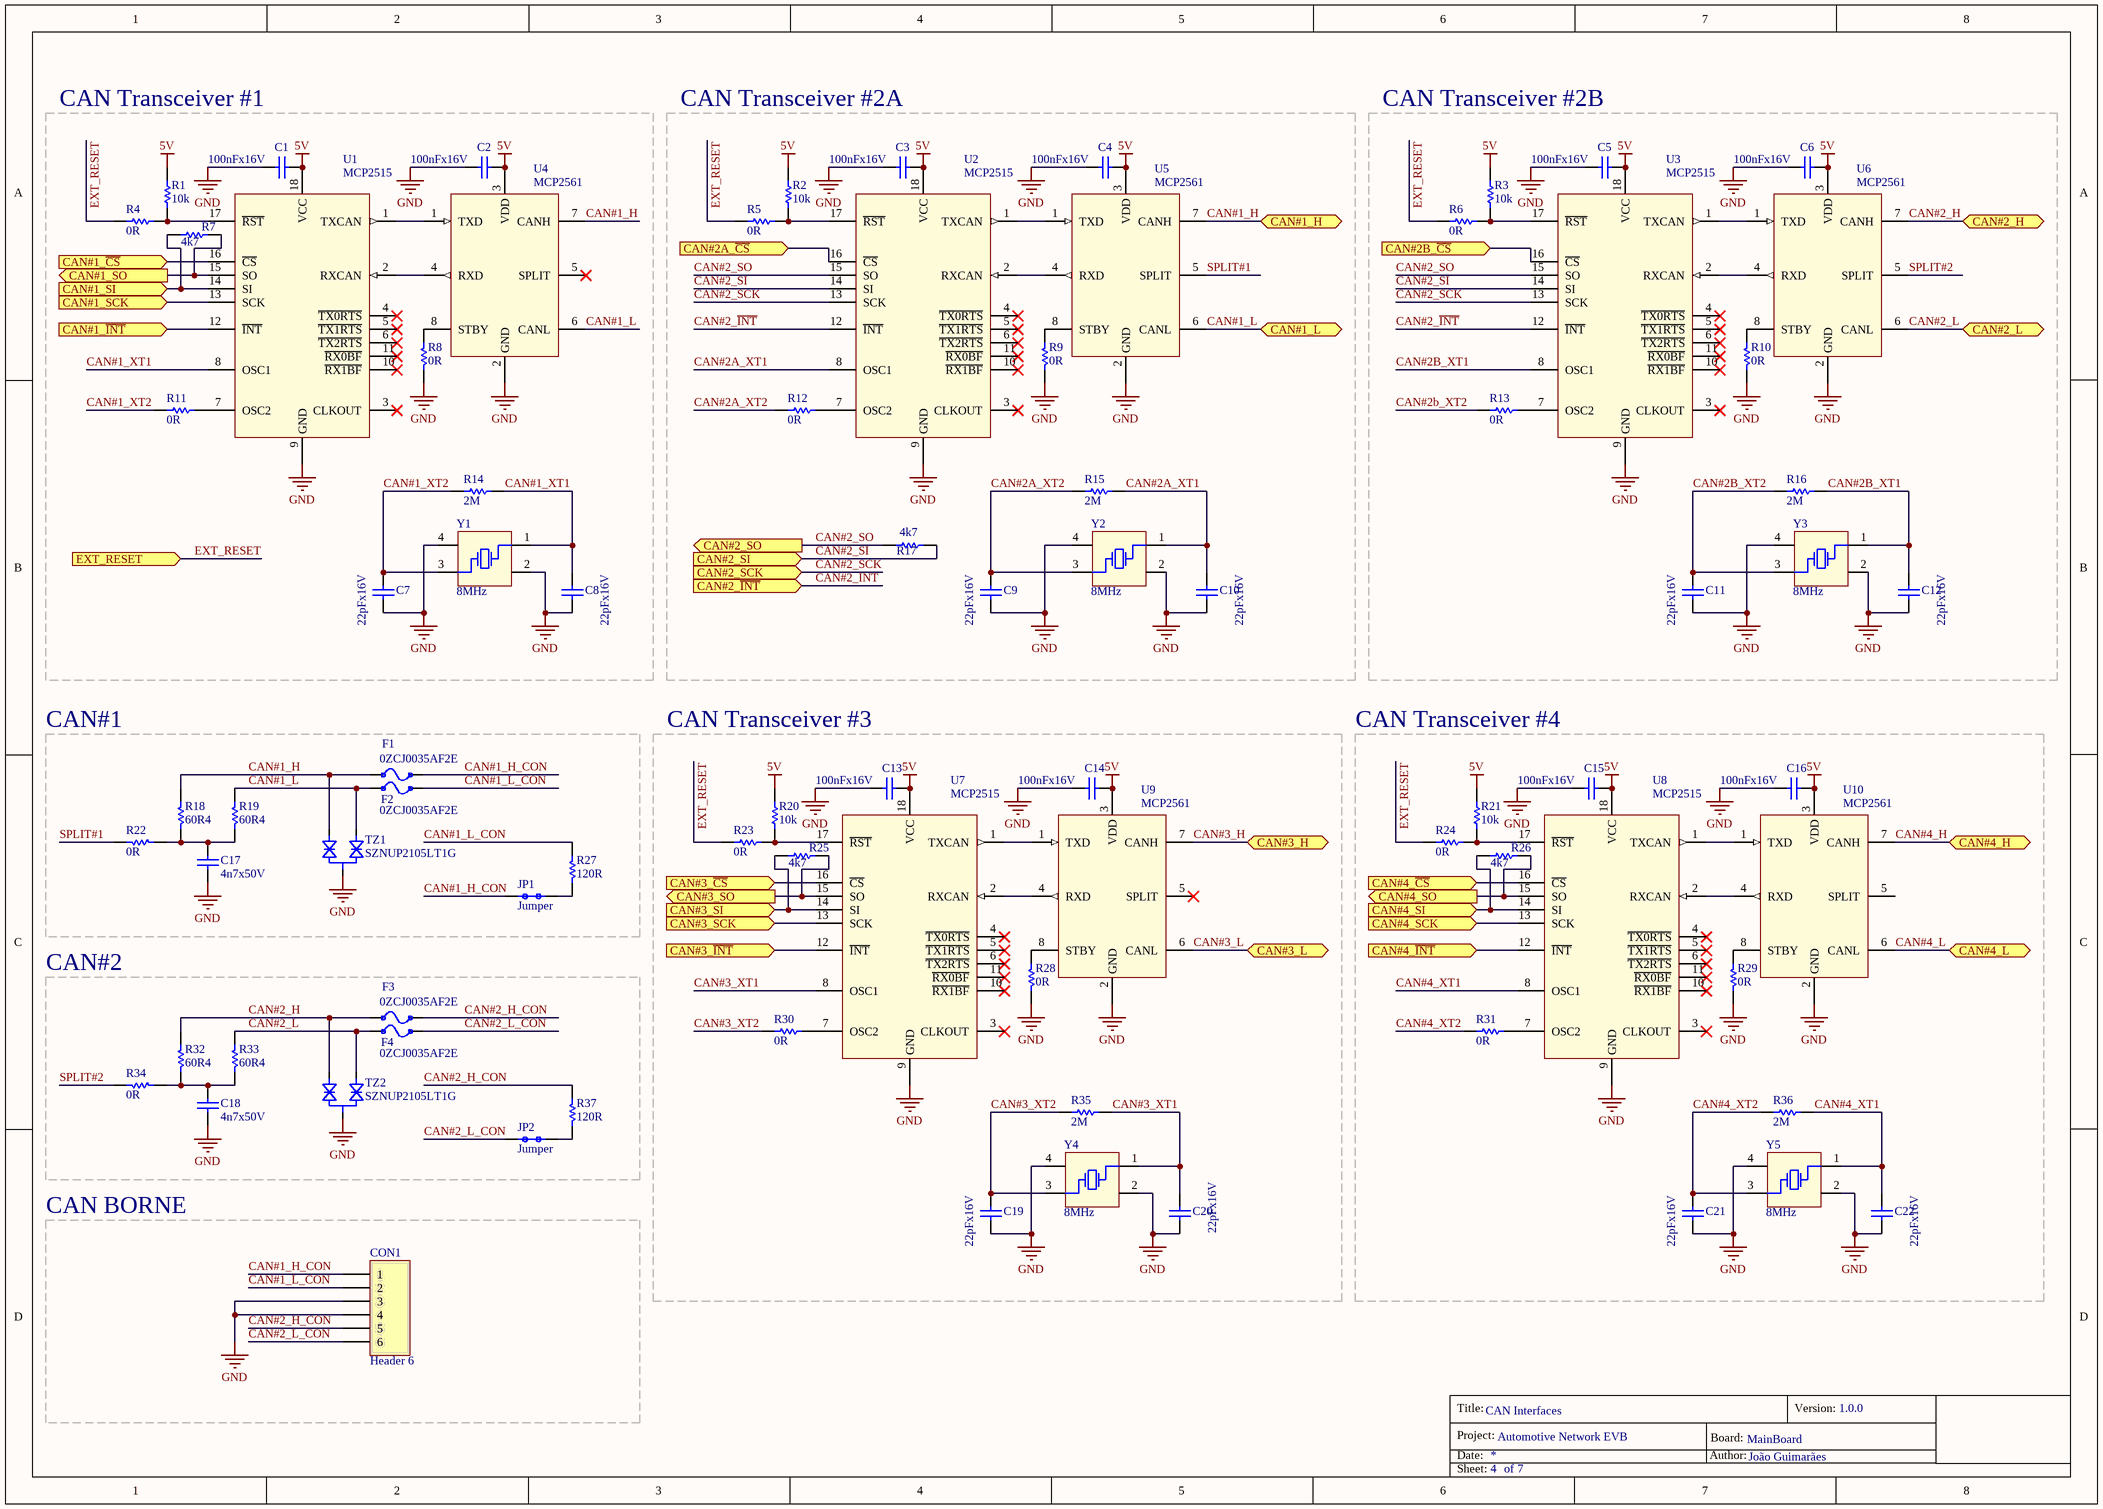
[diagram p3: CAN-BUS.SchDoc]

### Parts
C1  100nFx16V  [DISC-0603]
C2  100nFx16V  [DISC-0603]
C3  100nFx16V  [DISC-0603]
C4  100nFx16V  [DISC-0603]
C5  100nFx16V  [DISC-0603]
C6  100nFx16V  [DISC-0603]
C7  22pFx16V  [DISC-0603]
C8  22pFx16V  [DISC-0603]
C9  22pFx16V  [DISC-0603]
C10  22pFx16V  [DISC-0603]
C11  22pFx16V  [DISC-0603]
C12  22pFx16V  [DISC-0603]
C13  100nFx16V  [DISC-0603]
C14  100nFx16V  [DISC-0603]
C15  100nFx16V  [DISC-0603]
C16  100nFx16V  [DISC-0603]
C17  4n7x50V  [DISC-0603]
C18  4n7x50V  [DISC-0603]
C19  22pFx16V  [DISC-0603]
C20  22pFx16V  [DISC-0603]
C21  22pFx16V  [DISC-0603]
C22  22pFx16V  [DISC-0603]
CON1  Header 6  [CON-BORNE-6]
F1  0ZCJ0035AF2E  [DISC-FUSE-1206]
F2  0ZCJ0035AF2E  [DISC-FUSE-1206]
F3  0ZCJ0035AF2E  [DISC-FUSE-1206]
F4  0ZCJ0035AF2E  [DISC-FUSE-1206]
JP1  Jumper  [CON-HEADER-1X2-PTH]
JP2  Jumper  [CON-HEADER-1X2-PTH]
R1  10k  [DISC-0603]
R2  10k  [DISC-0603]
R3  10k  [DISC-0603]
R4  0R  [DISC-0603]
R5  0R  [DISC-0603]
R6  0R  [DISC-0603]
R7  4k7  [DISC-0603]
R8  0R  [DISC-0603]
R9  0R  [DISC-0603]
R10  0R  [DISC-0603]
R11  0R  [DISC-0603]
R12  0R  [DISC-0603]
R13  0R  [DISC-0603]
R14  2M  [DISC-0603]
R15  2M  [DISC-0603]
R16  2M  [DISC-0603]
R17  4k7  [DISC-0603]
R18  60R4  [DISC-1206]
R19  60R4  [DISC-1206]
R20  10k  [DISC-0603]
R21  10k  [DISC-0603]
R22  0R  [DISC-0603]
R23  0R  [DISC-0603]
R24  0R  [DISC-0603]
R25  4k7  [DISC-0603]
R26  4k7  [DISC-0603]
R27  120R  [DISC-1206]
R28  0R  [DISC-0603]
R29  0R  [DISC-0603]
R30  0R  [DISC-0603]
R31  0R  [DISC-0603]
R32  60R4  [DISC-1206]
R33  60R4  [DISC-1206]
R34  0R  [DISC-0603]
R35  2M  [DISC-0603]
R36  2M  [DISC-0603]
R37  120R  [DISC-1206]
TZ1  SZNUP2105LT1G  [DISC-SOT-23]
TZ2  SZNUP2105LT1G  [DISC-SOT-23]
U1  MCP2515  [CI-SOICW-18]
U2  MCP2515  [CI-SOICW-18]
U3  MCP2515  [CI-SOICW-18]
U4  MCP2561  [CI-SOIC-8]
U5  MCP2561  [CI-SOIC-8]
U6  MCP2561  [CI-SOIC-8]
U7  MCP2515  [CI-SOICW-18]
U8  MCP2515  [CI-SOICW-18]
U9  MCP2561  [CI-SOIC-8]
U10  MCP2561  [CI-SOIC-8]
Y1  8MHz  [DISC-CRYSTAL-4P-3.2X2.5]
Y2  8MHz  [DISC-CRYSTAL-4P-3.2X2.5]
Y3  8MHz  [DISC-CRYSTAL-4P-3.2X2.5]
Y4  8MHz  [DISC-CRYSTAL-4P-3.2X2.5]
Y5  8MHz  [DISC-CRYSTAL-4P-3.2X2.5]

### Blocks framed on the sheet
CAN Transceiver #1: C1 C2 C7 C8 R1 R4 R7 R8 R11 R14 U1 U4 Y1
CAN Transceiver #2A: C3 C4 C9 C10 R2 R5 R9 R12 R15 R17 U2 U5 Y2
CAN Transceiver #2B: C5 C6 C11 C12 R3 R6 R10 R13 R16 U3 U6 Y3
CAN#1: C17 F1 F2 JP1 R18 R19 R22 R27 TZ1
CAN Transceiver #3: C13 C14 C19 C20 R20 R23 R25 R28 R30 R35 U7 U9 Y4
CAN Transceiver #4: C15 C16 C21 C22 R21 R24 R26 R29 R31 R36 U8 U10 Y5
CAN#2: C18 F3 F4 JP2 R32-R34 R37 TZ2
CAN BORNE: CON1

### Ports
CAN#1_H (bidir), CAN#1_L (bidir), CAN#1_SCK (in), CAN#1_SI (in), CAN#1_SO (out), CAN#1_~{CS} (in), CAN#1_~{INT} (in), CAN#2_H (bidir), CAN#2_L (bidir), CAN#2_SCK (in), CAN#2_SI (in), CAN#2_SO (out), CAN#2_~{INT} (in), CAN#2A_~{CS} (in), CAN#2B_~{CS} (in), CAN#3_H (bidir), CAN#3_L (bidir), CAN#3_SCK (in), CAN#3_SI (in), CAN#3_SO (out), CAN#3_~{CS} (in), CAN#3_~{INT} (in), CAN#4_H (bidir), CAN#4_L (bidir), CAN#4_SCK (in), CAN#4_SI (in), CAN#4_SO (out), CAN#4_~{CS} (in), CAN#4_~{INT} (in), EXT_RESET (in)

### Nets
5V: C1.2 C2.2 C3.2 C4.2 C5.2 C6.2 C13.2 C14.2 C15.2 C16.2 R1.1 R2.1 R3.1 R20.1 R21.1 U1.18(VCC) U2.18(VCC) U3.18(VCC) U4.3(VDD) U5.3(VDD) U6.3(VDD) U7.18(VCC) U8.18(VCC) U9.3(VDD) U10.3(VDD)
GND: C1.1 C2.1 C3.1 C4.1 C5.1 C6.1 C7.1 C8.1 C9.1 C10.1 C11.1 C12.1 C13.1 C14.1 C15.1 C16.1 C17.1 C18.1 C19.1 C20.1 C21.1 C22.1 CON1.3 CON1.4 R8.1 R9.1 R10.1 R28.1 R29.1 TZ1.2(K) TZ2.2(K) U1.9(GND) U2.9(GND) U3.9(GND) U4.2(GND) U5.2(GND) U6.2(GND) U7.9(GND) U8.9(GND) U9.2(GND) U10.2(GND) Y1.2(GND) Y1.4(GND) Y2.2(GND) Y2.4(GND) Y3.2(GND) Y3.4(GND) Y4.2(GND) Y4.4(GND) Y5.2(GND) Y5.4(GND)
CAN#1_H: F1.1 R18.2 TZ1.1(A1) U4.7(CANH) U5.7(CANH) ; port CAN#1_H
CAN#1_H_CON: CON1.1 F1.2 JP1.1
CAN#1_L: F2.1 R19.2 TZ1.3(A2) U4.6(CANL) U5.6(CANL) ; port CAN#1_L
CAN#1_L_CON: CON1.2 F2.2 R27.1
CAN#1_XT1: C8.2 R14.2 U1.8(OSC1) Y1.1(OSC1)
CAN#1_XT2: C7.2 R11.2 R14.1 Y1.3(OSC2)
CAN#2_H: F3.1 R32.2 TZ2.1(A1) U6.7(CANH) ; port CAN#2_H
CAN#2_H_CON: CON1.5 F3.2 R37.1
CAN#2_~{INT}: U2.12(~{INT}) U3.12(~{INT}) ; port CAN#2_~{INT}
CAN#2_L: F4.1 R33.2 TZ2.3(A2) U6.6(CANL) ; port CAN#2_L
CAN#2_L_CON: CON1.6 F4.2 JP2.1
CAN#2_SCK: U2.13(SCK) U3.13(SCK) ; port CAN#2_SCK
CAN#2_SI: R17.1 U2.14(SI) U3.14(SI) ; port CAN#2_SI
CAN#2_SO: R17.2 U2.15(SO) U3.15(SO) ; port CAN#2_SO
CAN#2A_XT1: C10.2 R15.2 U2.8(OSC1) Y2.1(OSC1)
CAN#2A_XT2: C9.2 R12.2 R15.1 Y2.3(OSC2)
CAN#2B_XT1: C12.2 R16.2 U3.8(OSC1) Y3.1(OSC1)
CAN#2B_XT2: C11.2 R13.2 R16.1 Y3.3(OSC2)
CAN#3_H: U9.7(CANH) ; port CAN#3_H
CAN#3_L: U9.6(CANL) ; port CAN#3_L
CAN#3_XT1: C20.2 R35.2 U7.8(OSC1) Y4.1(OSC1)
CAN#3_XT2: C19.2 R30.2 R35.1 Y4.3(OSC2)
CAN#4_H: U10.7(CANH) ; port CAN#4_H
CAN#4_L: U10.6(CANL) ; port CAN#4_L
CAN#4_XT1: C22.2 R36.2 U8.8(OSC1) Y5.1(OSC1)
CAN#4_XT2: C21.2 R31.2 R36.1 Y5.3(OSC2)
EXT_RESET: R4.2 R5.2 R6.2 R23.2 R24.2 ; port EXT_RESET
SPLIT#1: R22.1 U5.5(SPLIT)
SPLIT#2: R34.1 U6.5(SPLIT)
NetC17_2: C17.2 R18.1 R19.1 R22.2
NetC18_2: C18.2 R32.1 R33.1 R34.2
NetCON3_5: U1.12(~{INT}) ; port CAN#1_~{INT}
NetCON3_13: U1.16(~{CS}) ; port CAN#1_~{CS}
NetCON3_14: R7.2 U1.14(SI) ; port CAN#1_SI
NetCON3_15: R7.1 U1.15(SO) ; port CAN#1_SO
NetCON3_16: U1.13(SCK) ; port CAN#1_SCK
NetCON4_9: U3.16(~{CS}) ; port CAN#2B_~{CS}
NetCON4_13: U2.16(~{CS}) ; port CAN#2A_~{CS}
NetCON5_5: U7.12(~{INT}) ; port CAN#3_~{INT}
NetCON5_13: U7.16(~{CS}) ; port CAN#3_~{CS}
NetCON5_14: R25.2 U7.14(SI) ; port CAN#3_SI
NetCON5_15: R25.1 U7.15(SO) ; port CAN#3_SO
NetCON5_16: U7.13(SCK) ; port CAN#3_SCK
NetCON6_5: U8.12(~{INT}) ; port CAN#4_~{INT}
NetCON6_13: U8.16(~{CS}) ; port CAN#4_~{CS}
NetCON6_14: R26.2 U8.14(SI) ; port CAN#4_SI
NetCON6_15: R26.1 U8.15(SO) ; port CAN#4_SO
NetCON6_16: U8.13(SCK) ; port CAN#4_SCK
NetJP1_2: JP1.2 R27.2
NetJP2_2: JP2.2 R37.2
NetR1_2: R1.2 R4.1 U1.17(~{RST})
NetR2_2: R2.2 R5.1 U2.17(~{RST})
NetR3_2: R3.2 R6.1 U3.17(~{RST})
NetR8_2: R8.2 U4.8(STBY)
NetR9_2: R9.2 U5.8(STBY)
NetR10_2: R10.2 U6.8(STBY)
NetR11_1: R11.1 U1.7(OSC2)
NetR12_1: R12.1 U2.7(OSC2)
NetR13_1: R13.1 U3.7(OSC2)
NetR20_2: R20.2 R23.1 U7.17(~{RST})
NetR21_2: R21.2 R24.1 U8.17(~{RST})
NetR28_2: R28.2 U9.8(STBY)
NetR29_2: R29.2 U10.8(STBY)
NetR30_1: R30.1 U7.7(OSC2)
NetR31_1: R31.1 U8.7(OSC2)
NetU1_1: U1.1(TXCAN) U4.1(TXD)
NetU1_2: U1.2(RXCAN) U4.4(RXD)
NetU2_1: U2.1(TXCAN) U5.1(TXD)
NetU2_2: U2.2(RXCAN) U5.4(RXD)
NetU3_1: U3.1(TXCAN) U6.1(TXD)
NetU3_2: U3.2(RXCAN) U6.4(RXD)
NetU7_1: U7.1(TXCAN) U9.1(TXD)
NetU7_2: U7.2(RXCAN) U9.4(RXD)
NetU8_1: U8.1(TXCAN) U10.1(TXD)
NetU8_2: U8.2(RXCAN) U10.4(RXD)

Not connected (* = marked no-connect by the designer): U1 3(CLKOUT)* 4(~{TX0RTS})* 5(~{TX1RTS})* 6(~{TX2RTS})* 10(~{RX1BF})* 11(~{RX0BF})*; U2 3(CLKOUT)* 4(~{TX0RTS})* 5(~{TX1RTS})* 6(~{TX2RTS})* 10(~{RX1BF})* 11(~{RX0BF})*; U3 3(CLKOUT)* 4(~{TX0RTS})* 5(~{TX1RTS})* 6(~{TX2RTS})* 10(~{RX1BF})* 11(~{RX0BF})*; U4 5(SPLIT)*; U7 3(CLKOUT)* 4(~{TX0RTS})* 5(~{TX1RTS})* 6(~{TX2RTS})* 10(~{RX1BF})* 11(~{RX0BF})*; U8 3(CLKOUT)* 4(~{TX0RTS})* 5(~{TX1RTS})* 6(~{TX2RTS})* 10(~{RX1BF})* 11(~{RX0BF})*; U9 5(SPLIT)*; U10 5(SPLIT)

### Notes on the sheet
- Title:
- Project:
- Date:
- Author:
- Board:
- Version:
- Sheet:
- of

### Library data of the parts
C1-C6 = Cap: Capacitor; Manufacturer1: Kemet; PartNumber1: C0603C104Z3VACTU; ClassName: CanBus
C7-C12 C19-C22 = Cap: Capacitor; PartNumber1: CC0603JPNPO0BN220; Manufacturer1: Yageo; ClassName: CanBus
C13-C16 = Cap: as C30 on sheet MCUs; ClassName: CanBus
C17 C18 = Cap: Capacitor; PartNumber1: C0603C472K5RAC7411; Manufacturer1: Kemet; ClassName: CanBus
CON1 = Header 6: Header, 3-Pin; ClassName: CanBus
F1-F4 = Fuse 1: Fuse; Manufacturer1: BelFuse; ClassName: CanBus; PartNumber1: 0ZCJ0035AF2E
JP1 JP2 = Jumper: Resistor; ClassName: CanBus
R1-R3 R20 R21 = Res: as R130 on sheet USB-UART; ClassName: CanBus
R4-R6 R8-R13 R22-R24 R28-R31 R34 = Res: as R121 on sheet USB-UART; ClassName: CanBus
R7 R17 R25 R26 = Res: Resistor; PartNumber1: RC0603JR-074K7L; Manufacturer1: Yageo; ClassName: CanBus
R14-R16 R35 R36 = Res: Resistor; PartNumber1: RC0603FR-102ML; Manufacturer1: Yageo; ClassName: CanBus
R18 R19 R32 R33 = Res: PartNumber1: ESR18EZPF60R4; Manufacturer1: ROHM; ClassName: CanBus
R27 R37 = Res: 60R4; PartNumber1: AC1206JR-07120RL; Manufacturer1: Yageo; ClassName: CanBus
TZ1 TZ2 = TVZ-Bi-Dual: TVZ-Bi-Directional; Manufacturer1: ONSemi; ClassName: CanBus; PartNumber1: SZNUP2105LT1G
U1-U3 U7 U8 = MCP2515: Stand-Alone CAN Controller With SPI Interface; PartNumber1: MCP2515-I/SO; Manufacturer1: Microchip; ClassName: CanBus
U4-U6 U9 U10 = MCP2561: High speed CAN transceiver; PartNumber1: MCP2561T-E/SN; Manufacturer1: Microchip; ClassName: CanBus
Y1-Y5 = XTAL-4-PIN: PartNumber1: ECS-80-18-33-JGN-TR; Manufacturer1: ECS; ClassName: CanBus

## Sheet LIN-BUS.SchDoc: LIN Interfaces
size A4; Author: João Guimarães; Organization: Altium Limited; Address1: L3, 12a Rodborough Rd; Address2: Frenchs Forest; Address3: NSW; Address4: Australia 2086; Revision: 1.0; SheetNumber: 6; SheetTotal: 7
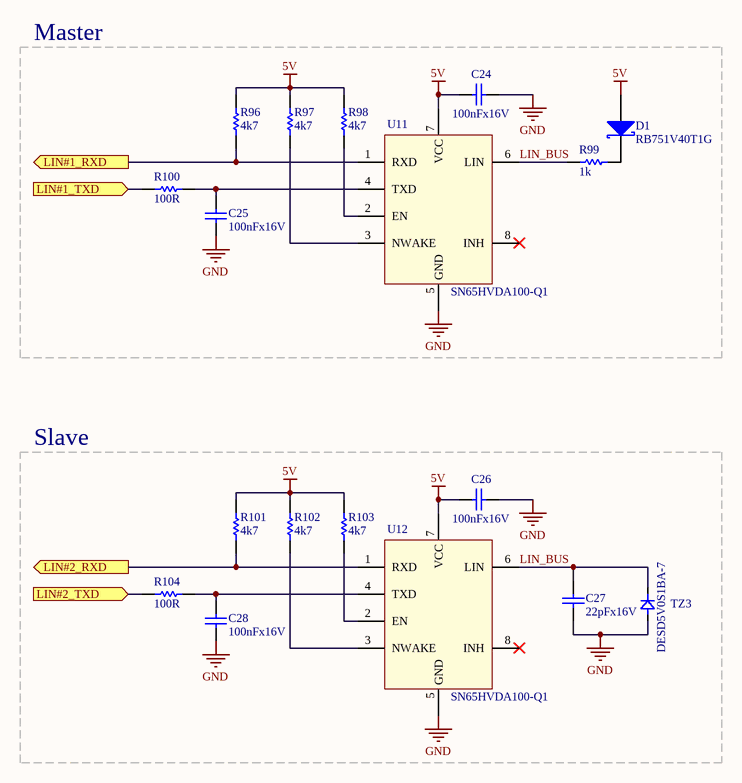
[diagram p4: LIN-BUS.SchDoc]

### Parts
C24  100nFx16V  [DISC-0603]
C25  100nFx16V  [DISC-0603]
C26  100nFx16V  [DISC-0603]
C27  22pFx16V  [DISC-0603]
C28  100nFx16V  [DISC-0603]
D1  RB751V40T1G  [DISC-SOD-323]
R96  4k7  [DISC-0603]
R97  4k7  [DISC-0603]
R98  4k7  [DISC-0603]
R99  1k  [DISC-0603]
R100  100R  [DISC-0603]
R101  4k7  [DISC-0603]
R102  4k7  [DISC-0603]
R103  4k7  [DISC-0603]
R104  100R  [DISC-0603]
TZ3  DESD5V0S1BA-7  [DISC-SOD-323]
U11  SN65HVDA100-Q1  [CI-SOIC-8]
U12  SN65HVDA100-Q1  [CI-SOIC-8]

### Blocks framed on the sheet
Master: C24 C25 D1 R96-R100 U11
Slave: C26-C28 R101-R104 TZ3 U12

### Ports
LIN#1_RXD (out), LIN#1_TXD (in), LIN#2_RXD (out), LIN#2_TXD (in)

### Nets
5V: C24.2 C26.2 D1.1(A) R96.2 R97.2 R98.2 R101.2 R102.2 R103.2 U11.7(VCC) U12.7(VCC)
GND: C24.1 C25.1 C26.1 C27.1 C28.1 TZ3.1(A) U11.5(GND) U12.5(GND)
LIN_BUS: C27.2 R99.2 TZ3.2(C) U11.6(LIN) U12.6(LIN)
NetC25_2: C25.2 R100.1 U11.4(TXD)
NetC28_2: C28.2 R104.1 U12.4(TXD)
NetCON5_8: R100.2 ; port LIN#1_TXD
NetCON5_9: R96.1 U11.1(RXD) ; port LIN#1_RXD
NetCON6_8: R104.2 ; port LIN#2_TXD
NetCON6_9: R101.1 U12.1(RXD) ; port LIN#2_RXD
NetD1_2: D1.2(K) R99.1
NetR97_1: R97.1 U11.3(NWAKE)
NetR98_1: R98.1 U11.2(EN)
NetR102_1: R102.1 U12.3(NWAKE)
NetR103_1: R103.1 U12.2(EN)

Not connected (* = marked no-connect by the designer): U11 8(INH)*; U12 8(INH)*

### Notes on the sheet
- Title:
- Project:
- Date:
- Author:
- Board:
- Version:
- Sheet:
- of

### Library data of the parts
C24-C26 C28 = Cap: as C30 on sheet MCUs; ClassName: LinBus
C27 = Cap: PartNumber1: CC0603JPNPO0BN220; Manufacturer1: Yageo; ClassName: LinBus
D1 = D Schottky: Schottky Diode; Manufacturer1: ONSemi; ClassName: LinBus; PartNumber1: RB751V40T1G
R96-R98 R101-R103 = Res: as R7 on sheet CAN-BUS; ClassName: LinBus
R99 = Res: as R126 on sheet USB-UART; ClassName: LinBus
R100 R104 = Res: Resistor; PartNumber1: RC0603JR-07100RL; Manufacturer1: Yageo; ClassName: LinBus
TZ3 = TVZ-Unidirectional: Manufacturer1: Diodes; ClassName: LinBus; PartNumber1: DESD5V0S1BA-7
U11 U12 = SN65HVDA100-Q1: LIN Transceiver; Manufacturer1: TexasInstruments; ClassName: LinBus; PartNumber1: SN65HVDA100-Q1

## Sheet EXTERNAL-INTERFACES.SchDoc: External Interfaces
size A3; Author: João Guimarães; Revision: 1.0.0; SheetNumber: 7; SheetTotal: 7; Project: Automotive Network EVB; PCB: MainBoard; Version: 1.0.0
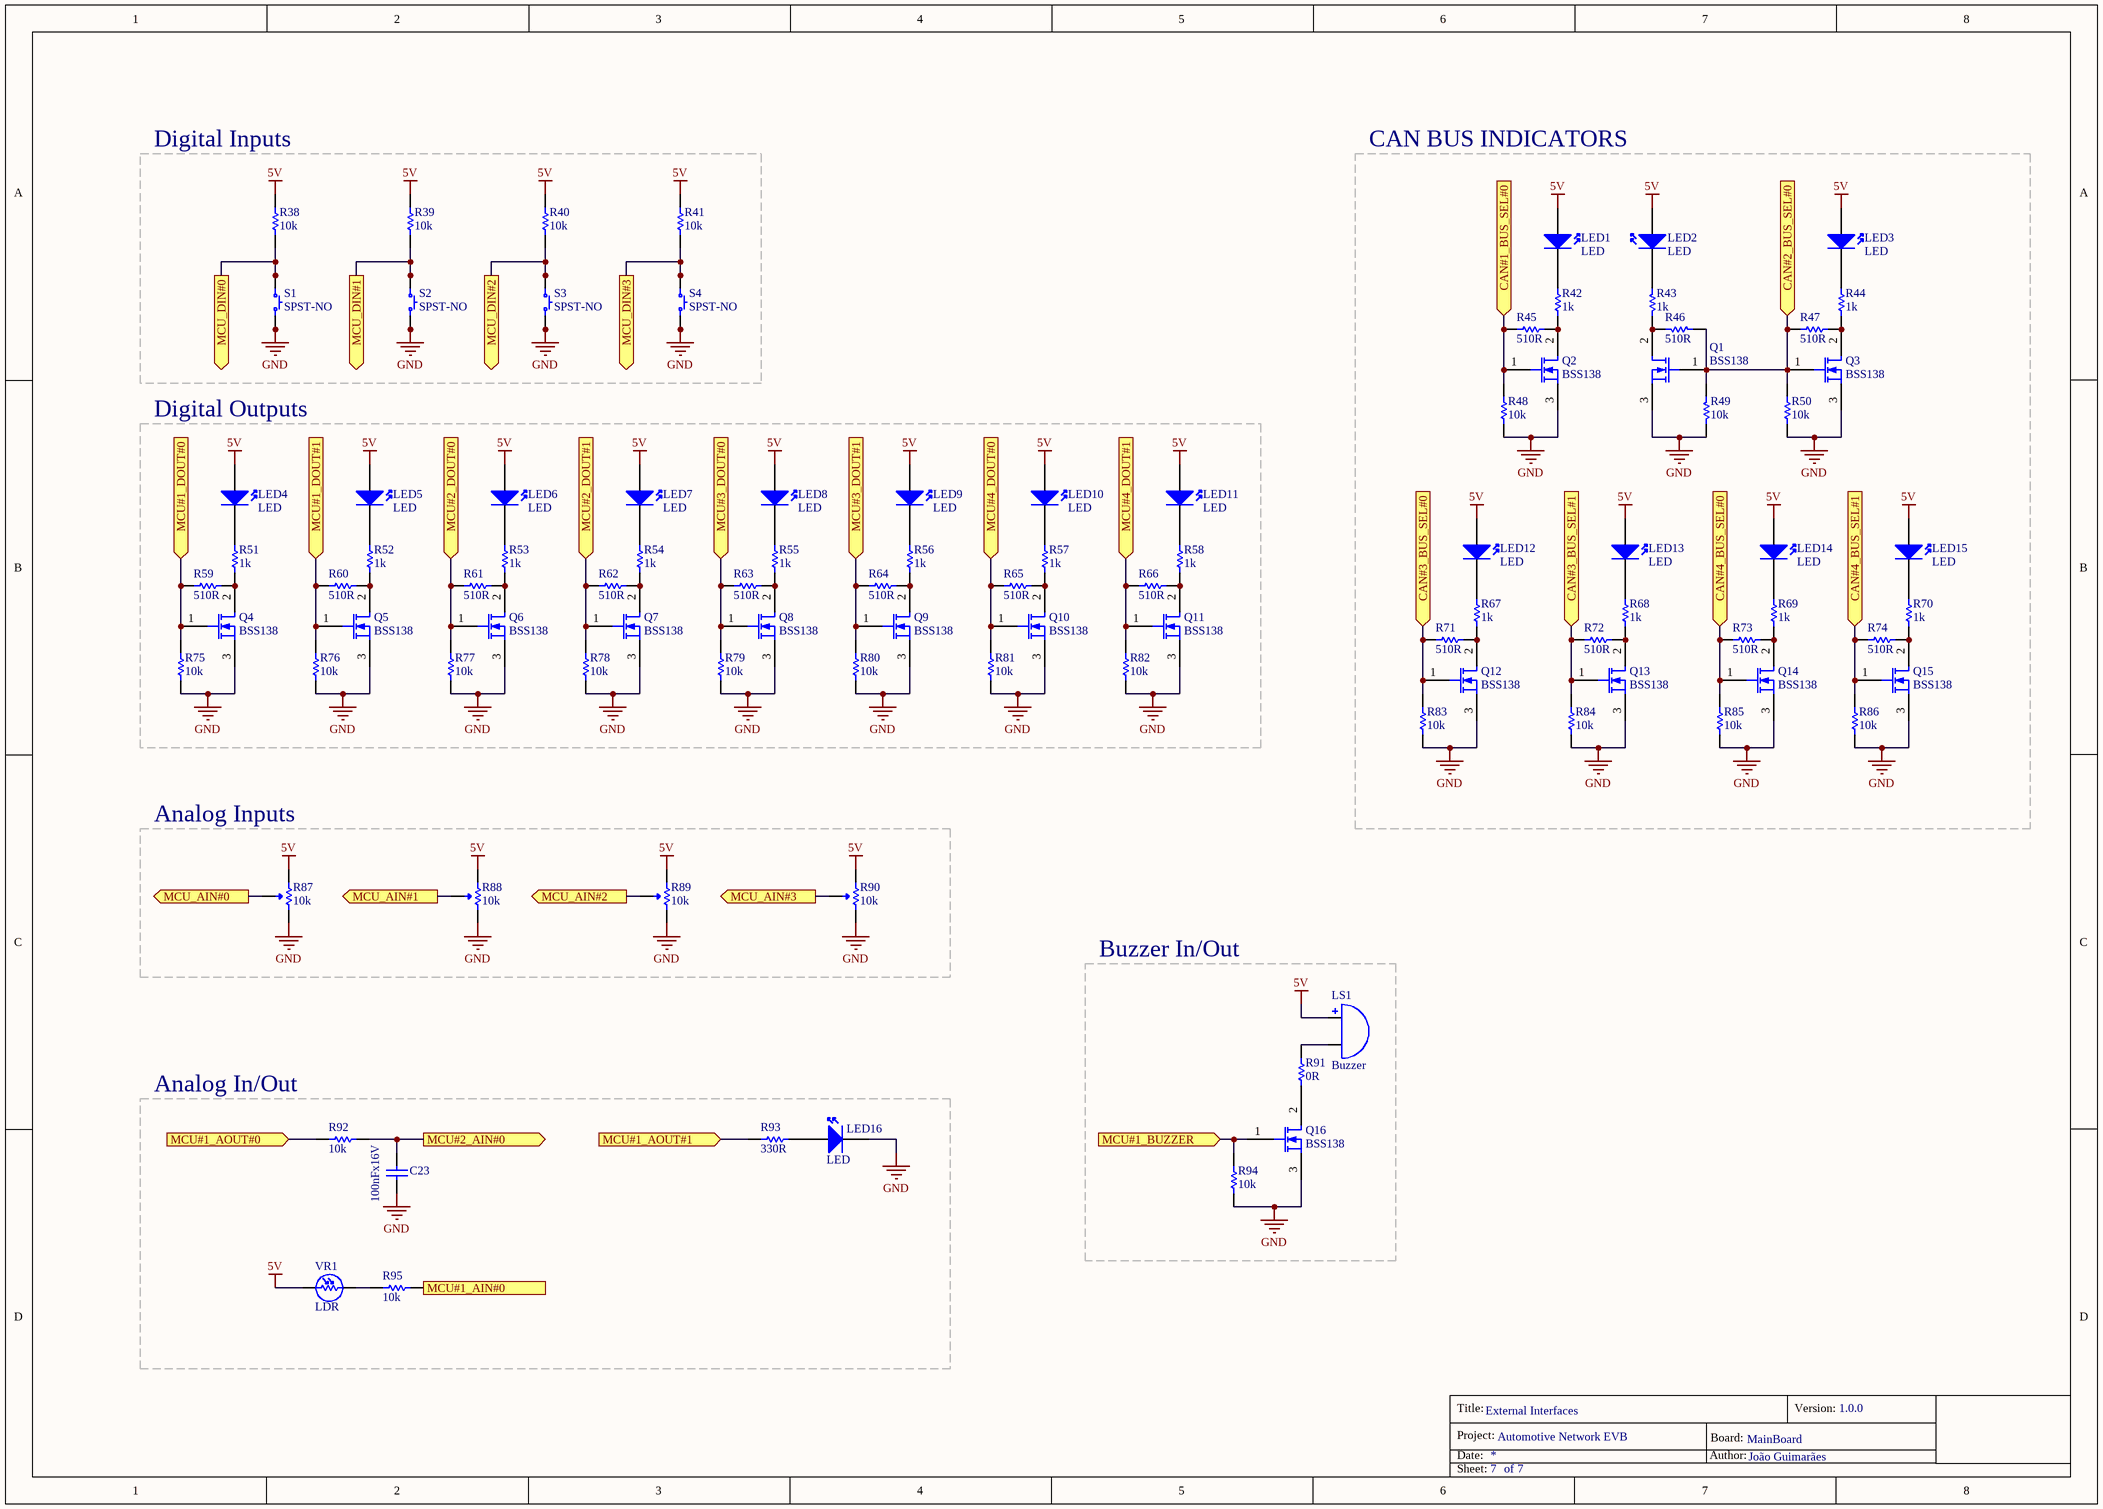
[diagram p5: EXTERNAL-INTERFACES.SchDoc]

### Parts
C23  100nFx16V  [DISC-0603]
LED1  LED  [DISC-LED-1206]
LED2  LED  [DISC-LED-1206]
LED3  LED  [DISC-LED-1206]
LED4  LED  [DISC-LED-0.1-PTH]
LED5  LED  [DISC-LED-0.1-PTH]
LED6  LED  [DISC-LED-0.1-PTH]
LED7  LED  [DISC-LED-0.1-PTH]
LED8  LED  [DISC-LED-0.1-PTH]
LED9  LED  [DISC-LED-0.1-PTH]
LED10  LED  [DISC-LED-0.1-PTH]
LED11  LED  [DISC-LED-0.1-PTH]
LED12  LED  [DISC-LED-1206]
LED13  LED  [DISC-LED-1206]
LED14  LED  [DISC-LED-1206]
LED15  LED  [DISC-LED-1206]
LED16  LED  [DISC-LED-0.1-PTH]
LS1  Buzzer  [DISC-BUZZER-0.3-PTH]
Q1  BSS138  [DISC-SOT-23]
Q2  BSS138  [DISC-SOT-23]
Q3  BSS138  [DISC-SOT-23]
Q4  BSS138  [DISC-SOT-23]
Q5  BSS138  [DISC-SOT-23]
Q6  BSS138  [DISC-SOT-23]
Q7  BSS138  [DISC-SOT-23]
Q8  BSS138  [DISC-SOT-23]
Q9  BSS138  [DISC-SOT-23]
Q10  BSS138  [DISC-SOT-23]
Q11  BSS138  [DISC-SOT-23]
Q12  BSS138  [DISC-SOT-23]
Q13  BSS138  [DISC-SOT-23]
Q14  BSS138  [DISC-SOT-23]
Q15  BSS138  [DISC-SOT-23]
Q16  BSS138  [DISC-SOT-23]
R38  10k  [DISC-0603]
R39  10k  [DISC-0603]
R40  10k  [DISC-0603]
R41  10k  [DISC-0603]
R42  1k  [DISC-0603]
R43  1k  [DISC-0603]
R44  1k  [DISC-0603]
R45  510R  [DISC-0603]
R46  510R  [DISC-0603]
R47  510R  [DISC-0603]
R48  10k  [DISC-0603]
R49  10k  [DISC-0603]
R50  10k  [DISC-0603]
R51  1k  [DISC-0603]
R52  1k  [DISC-0603]
R53  1k  [DISC-0603]
R54  1k  [DISC-0603]
R55  1k  [DISC-0603]
R56  1k  [DISC-0603]
R57  1k  [DISC-0603]
R58  1k  [DISC-0603]
R59  510R  [DISC-0603]
R60  510R  [DISC-0603]
R61  510R  [DISC-0603]
R62  510R  [DISC-0603]
R63  510R  [DISC-0603]
R64  510R  [DISC-0603]
R65  510R  [DISC-0603]
R66  510R  [DISC-0603]
R67  1k  [DISC-0603]
R68  1k  [DISC-0603]
R69  1k  [DISC-0603]
R70  1k  [DISC-0603]
R71  510R  [DISC-0603]
R72  510R  [DISC-0603]
R73  510R  [DISC-0603]
R74  510R  [DISC-0603]
R75  10k  [DISC-0603]
R76  10k  [DISC-0603]
R77  10k  [DISC-0603]
R78  10k  [DISC-0603]
R79  10k  [DISC-0603]
R80  10k  [DISC-0603]
R81  10k  [DISC-0603]
R82  10k  [DISC-0603]
R83  10k  [DISC-0603]
R84  10k  [DISC-0603]
R85  10k  [DISC-0603]
R86  10k  [DISC-0603]
R87  10k  [DISC-TRIMPOT-TSR-3386]
R88  10k  [DISC-TRIMPOT-TSR-3386]
R89  10k  [DISC-TRIMPOT-TSR-3386]
R90  10k  [DISC-TRIMPOT-TSR-3386]
R91  0R  [DISC-0603]
R92  10k  [DISC-0603]
R93  330R  [DISC-0603]
R94  10k  [DISC-0603]
R95  10k  [DISC-0603]
S1  SPST-NO  [DISC-PUSHBUTTON-4P-PTH]
S2  SPST-NO  [DISC-PUSHBUTTON-4P-PTH]
S3  SPST-NO  [DISC-PUSHBUTTON-4P-PTH]
S4  SPST-NO  [DISC-PUSHBUTTON-4P-PTH]
VR1  LDR  [DISC-LDR]

### Blocks framed on the sheet
Digital Inputs: R38-R41 S1-S4
CAN BUS INDICATORS: LED1-LED3 LED12-LED15 Q1-Q3 Q12-Q15 R42-R50 R67-R74 R83-R86
Digital Outputs: LED4-LED11 Q4-Q11 R51-R66 R75-R82
Analog Inputs: R87-R90
Buzzer In/Out: LS1 Q16 R91 R94
Analog In/Out: C23 LED16 R92 R93 R95 VR1

### Ports
CAN#1_BUS_SEL#0 (in), CAN#2_BUS_SEL#0 (in), CAN#3_BUS_SEL#0 (in), CAN#3_BUS_SEL#1 (in), CAN#4_BUS_SEL#0 (in), CAN#4_BUS_SEL#1 (in), MCU#1_AIN#0 (out), MCU#1_AOUT#0 (in), MCU#1_AOUT#1 (in), MCU#1_BUZZER (in), MCU#1_DOUT#0 (in), MCU#1_DOUT#1 (in), MCU#2_AIN#0 (out), MCU#2_DOUT#0 (in), MCU#2_DOUT#1 (in), MCU#3_DOUT#0 (in), MCU#3_DOUT#1 (in), MCU#4_DOUT#0 (in), MCU#4_DOUT#1 (in), MCU_AIN#0 (out), MCU_AIN#1 (out), MCU_AIN#2 (out), MCU_AIN#3 (out), MCU_DIN#0 (out), MCU_DIN#1 (out), MCU_DIN#2 (out), MCU_DIN#3 (out)

### Nets
5V: LED1.1(A) LED2.1(A) LED3.1(A) LED4.1(A) LED5.1(A) LED6.1(A) LED7.1(A) LED8.1(A) LED9.1(A) LED10.1(A) LED11.1(A) LED12.1(A) LED13.1(A) LED14.1(A) LED15.1(A) LS1.1 R38.2 R39.2 R40.2 R41.2 R87.3 R88.3 R89.3 R90.3 VR1.1
GND: C23.2 LED16.2(K) Q1.3(S) Q2.3(S) Q3.3(S) Q4.3(S) Q5.3(S) Q6.3(S) Q7.3(S) Q8.3(S) Q9.3(S) Q10.3(S) Q11.3(S) Q12.3(S) Q13.3(S) Q14.3(S) Q15.3(S) Q16.3(S) R48.1 R49.1 R50.1 R75.1 R76.1 R77.1 R78.1 R79.1 R80.1 R81.1 R82.1 R83.1 R84.1 R85.1 R86.1 R87.1 R88.1 R89.1 R90.1 R94.1 S1.3 S1.4 S2.3 S2.4 S3.3 S3.4 S4.3 S4.4
MCU_AIN#0: R87.2 ; port MCU_AIN#0
MCU_AIN#1: R88.2 ; port MCU_AIN#1
MCU_AIN#2: R89.2 ; port MCU_AIN#2
MCU_AIN#3: R90.2 ; port MCU_AIN#3
MCU_DIN#0: R38.1 S1.1 S1.2 ; port MCU_DIN#0
MCU_DIN#1: R39.1 S2.1 S2.2 ; port MCU_DIN#1
MCU_DIN#2: R40.1 S3.1 S3.2 ; port MCU_DIN#2
MCU_DIN#3: R41.1 S4.1 S4.2 ; port MCU_DIN#3
NetC23_1: C23.1 R92.2 ; port MCU#2_AIN#0
NetCON3_6: Q4.1(g) R59.2 R75.2 ; port MCU#1_DOUT#0
NetCON3_7: Q5.1(g) R60.2 R76.2 ; port MCU#1_DOUT#1
NetCON3_8: R92.1 ; port MCU#1_AOUT#0
NetCON3_9: R93.2 ; port MCU#1_AOUT#1
NetCON3_10: Q16.1(g) R94.2 ; port MCU#1_BUZZER
NetCON3_25: R95.2 ; port MCU#1_AIN#0
NetCON4_6: Q6.1(g) R61.2 R77.2 ; port MCU#2_DOUT#0
NetCON4_7: Q7.1(g) R62.2 R78.2 ; port MCU#2_DOUT#1
NetCON5_6: Q8.1(g) R63.2 R79.2 ; port MCU#3_DOUT#0
NetCON5_7: Q9.1(g) R64.2 R80.2 ; port MCU#3_DOUT#1
NetCON6_6: Q10.1(g) R65.2 R81.2 ; port MCU#4_DOUT#0
NetCON6_7: Q11.1(g) R66.2 R82.2 ; port MCU#4_DOUT#1
NetLED1_2: LED1.2(K) R42.2
NetLED2_2: LED2.2(K) R43.2
NetLED3_2: LED3.2(K) R44.2
NetLED4_2: LED4.2(K) R51.2
NetLED5_2: LED5.2(K) R52.2
NetLED6_2: LED6.2(K) R53.2
NetLED7_2: LED7.2(K) R54.2
NetLED8_2: LED8.2(K) R55.2
NetLED9_2: LED9.2(K) R56.2
NetLED10_2: LED10.2(K) R57.2
NetLED11_2: LED11.2(K) R58.2
NetLED12_2: LED12.2(K) R67.2
NetLED13_2: LED13.2(K) R68.2
NetLED14_2: LED14.2(K) R69.2
NetLED15_2: LED15.2(K) R70.2
NetLED16_1: LED16.1(A) R93.1
NetLS1_2: LS1.2 R91.2
NetQ1_1: Q1.1(g) Q3.1(g) R46.2 R47.2 R49.2 R50.2 ; port CAN#2_BUS_SEL#0
NetQ1_2: Q1.2(D) R43.1 R46.1
NetQ2_1: Q2.1(g) R45.2 R48.2 ; port CAN#1_BUS_SEL#0
NetQ2_2: Q2.2(D) R42.1 R45.1
NetQ3_2: Q3.2(D) R44.1 R47.1
NetQ4_2: Q4.2(D) R51.1 R59.1
NetQ5_2: Q5.2(D) R52.1 R60.1
NetQ6_2: Q6.2(D) R53.1 R61.1
NetQ7_2: Q7.2(D) R54.1 R62.1
NetQ8_2: Q8.2(D) R55.1 R63.1
NetQ9_2: Q9.2(D) R56.1 R64.1
NetQ10_2: Q10.2(D) R57.1 R65.1
NetQ11_2: Q11.2(D) R58.1 R66.1
NetQ12_1: Q12.1(g) R71.2 R83.2 ; port CAN#3_BUS_SEL#0
NetQ12_2: Q12.2(D) R67.1 R71.1
NetQ13_1: Q13.1(g) R72.2 R84.2 ; port CAN#3_BUS_SEL#1
NetQ13_2: Q13.2(D) R68.1 R72.1
NetQ14_1: Q14.1(g) R73.2 R85.2 ; port CAN#4_BUS_SEL#0
NetQ14_2: Q14.2(D) R69.1 R73.1
NetQ15_1: Q15.1(g) R74.2 R86.2 ; port CAN#4_BUS_SEL#1
NetQ15_2: Q15.2(D) R70.1 R74.1
NetQ16_2: Q16.2(D) R91.1
NetR95_1: R95.1 VR1.2

### Notes on the sheet
- Title:
- Project:
- Date:
- Author:
- Board:
- Version:
- Sheet:
- of

### Library data of the parts
C23 = Cap: as C30 on sheet MCUs; ClassName: Mcu
LED1 LED2 LED12 LED14 = LED: PartNumber1: BR1101W-TR; Manufacturer1: Stanley; ClassName: ExternalInterfaces
LED3 LED13 LED15 = LED: PartNumber1: AY1101W-TR; Manufacturer1: Stanley; ClassName: ExternalInterfaces
Q1-Q16 = Transistor-NMOS(GDS): Transistor NMOS; PartNumber1: BSS138-13-F; Manufacturer1: Diodes; ClassName: ExternalInterfaces
R38-R41 R48-R50 R75-R86 R94 = Res: PartNumber1: RC0603FR-0710KL; Manufacturer1: Yageo; ClassName: ExternalInterfaces
R42-R44 R51-R58 R68-R70 = Res: PartNumber1: RC0603FR-071KL; Manufacturer1: Yageo; ClassName: ExternalInterfaces
R45-R47 R59-R67 R71-R74 R91 = Res: PartNumber1: RC0603JR-070RL; Manufacturer1: Yageo; ClassName: ExternalInterfaces
R87-R90 = VariableResistor: COM-09806; Manufacturer1: SparkFun; ClassName: ExternalInterfaces; PartNumber1: COM-09806
R92 R95 = Res: as R130 on sheet USB-UART; ClassName: ExternalInterfaces
R93 = Res: PartNumber1: RC0603FR-07330RL; Manufacturer1: Yageo; ClassName: ExternalInterfaces
VR1 = LDR: Resistor; ClassName: ExternalInterfaces; Manufacturer1: *; PartNumber1: *
LED4-LED11 LED16 = LED: ClassName: ExternalInterfaces
S1-S4 = SPST-NO: ClassName: *; PartNumber1: *; Manufacturer1: *

## Sheet MODE-SELECTOR.SchDoc: Mode Selector
size A4; Author: João Guimarães; Organization: Altium Limited; Address1: L3, 12a Rodborough Rd; Address2: Frenchs Forest; Address3: NSW; Address4: Australia 2086; Revision: 1.0; SheetNumber: 5; SheetTotal: 7
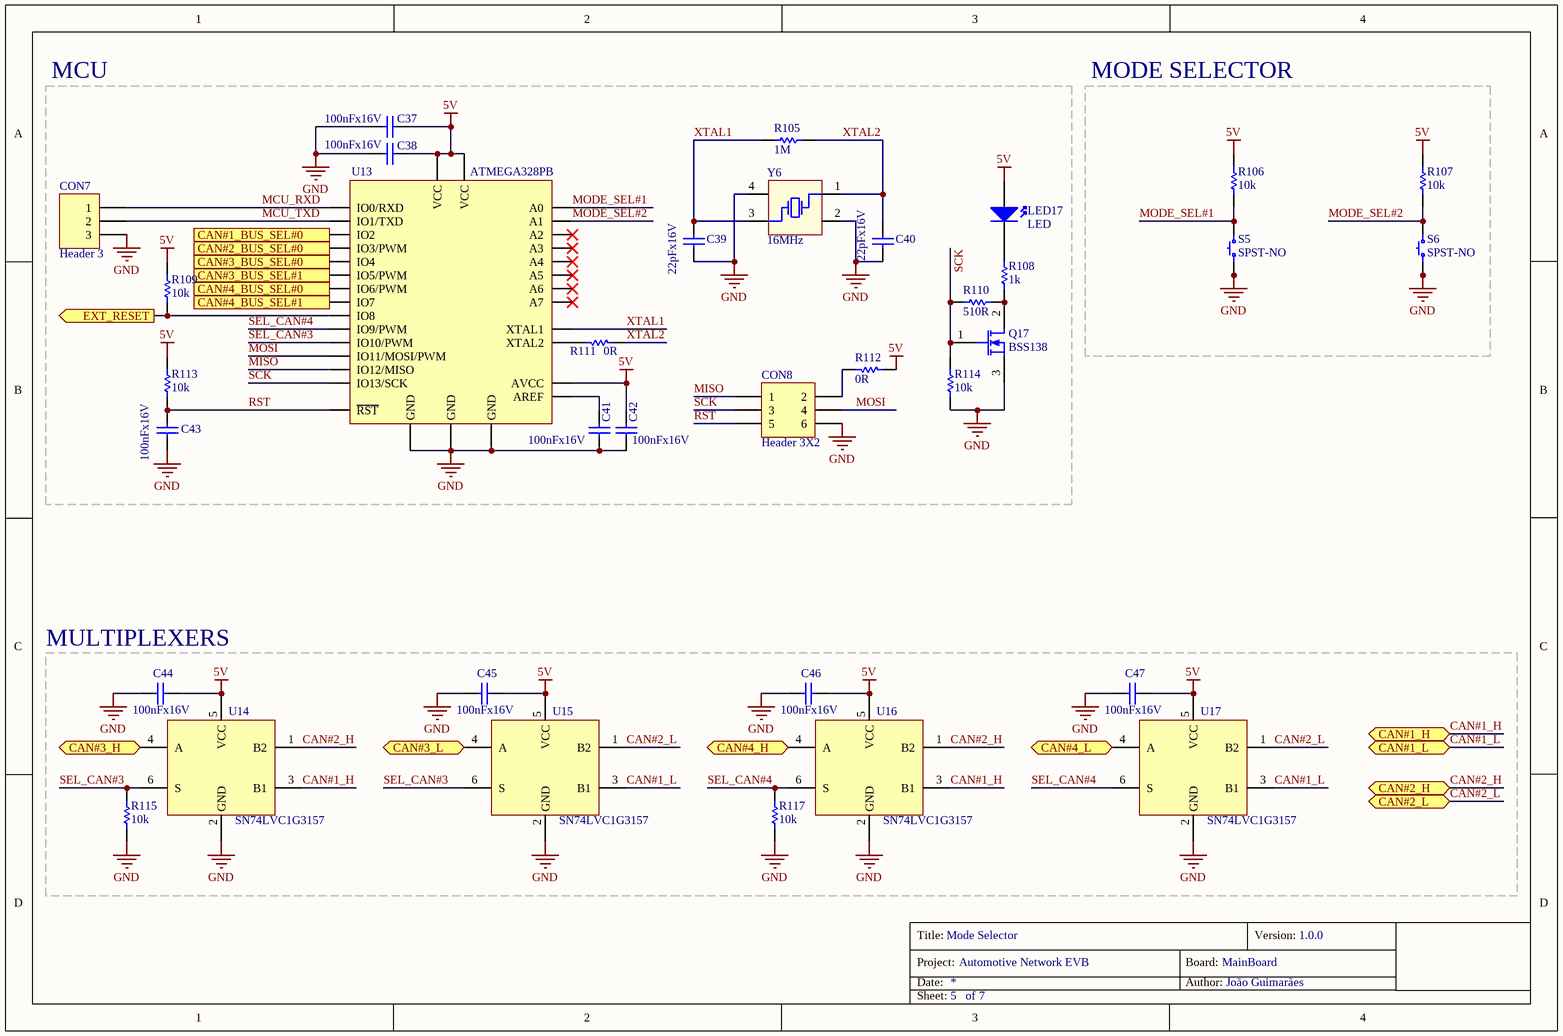
[diagram p6: MODE-SELECTOR.SchDoc]

### Parts
C37  100nFx16V  [DISC-0603]
C38  100nFx16V  [DISC-0603]
C39  22pFx16V  [DISC-0603]
C40  22pFx16V  [DISC-0603]
C41  100nFx16V  [DISC-0603]
C42  100nFx16V  [DISC-0603]
C43  100nFx16V  [DISC-0603]
C44  100nFx16V  [DISC-0603]
C45  100nFx16V  [DISC-0603]
C46  100nFx16V  [DISC-0603]
C47  100nFx16V  [DISC-0603]
CON7  Header 3  [CON-HEADER-1X3-PTH]
CON8  Header 3X2  [CON-HEADER-2X3-SMD]
LED17  LED  [DISC-LED-1206]
Q17  BSS138  [DISC-SOT-23]
R105  1M  [DISC-0603]
R106  10k  [DISC-0603]
R107  10k  [DISC-0603]
R108  1k  [DISC-0603]
R109  10k  [DISC-0603]
R110  510R  [DISC-0603]
R111  0R  [DISC-0603]
R112  0R  [DISC-0603]
R113  10k  [DISC-0603]
R114  10k  [DISC-0603]
R115  10k  [DISC-0603]
R117  10k  [DISC-0603]
S5  SPST-NO  [DISC-PUSHBUTTON-4P-PTH]
S6  SPST-NO  [DISC-PUSHBUTTON-4P-PTH]
U13  ATMEGA328PB  [CI-QFP-32]
U14  SN74LVC1G3157  [CI-SOT-23-6]
U15  SN74LVC1G3157  [CI-SOT-23-6]
U16  SN74LVC1G3157  [CI-SOT-23-6]
U17  SN74LVC1G3157  [CI-SOT-23-6]
Y6  16MHz  [DISC-CRYSTAL-4P-3.2X2.5]

### Blocks framed on the sheet
MCU: C37-C43 CON7 CON8 LED17 Q17 R105 R108-R114 U13 Y6
MODE SELECTOR: R106 R107 S5 S6
MULTIPLEXERS: C44-C47 R115 R117 U14-U17

### Ports
CAN#1_BUS_SEL#0 (out), CAN#1_H (bidir), CAN#1_L (bidir), CAN#2_BUS_SEL#0 (out), CAN#2_H (bidir), CAN#2_L (bidir), CAN#3_BUS_SEL#0 (out), CAN#3_BUS_SEL#1 (out), CAN#3_H (bidir), CAN#3_L (bidir), CAN#4_BUS_SEL#0 (out), CAN#4_BUS_SEL#1 (out), CAN#4_H (bidir), CAN#4_L (bidir), EXT_RESET (out)

### Nets
5V: C37.2 C38.2 C42.1 C44.2 C45.2 C46.2 C47.2 LED17.1(A) R106.1 R107.1 R109.1 R112.2 R113.1 U13.4(VCC) U13.6(VCC) U13.18(AVCC) U14.5(VCC) U15.5(VCC) U16.5(VCC) U17.5(VCC)
GND: C37.1 C38.1 C39.1 C40.1 C41.2 C42.2 C43.2 C44.1 C45.1 C46.1 C47.1 CON7.3 CON8.6 Q17.3(S) R114.1 R115.2 R117.2 S5.1 S5.2 S6.1 S6.2 U13.3(GND) U13.5(GND) U13.21(GND) U14.2(GND) U15.2(GND) U16.2(GND) U17.2(GND) Y6.2(GND) Y6.4(GND)
CAN#1_H: U14.3(B1) U16.3(B1) ; port CAN#1_H
CAN#1_L: U15.3(B1) U17.3(B1) ; port CAN#1_L
CAN#2_H: U14.1(B2) U16.1(B2) ; port CAN#2_H
CAN#2_L: U15.1(B2) U17.1(B2) ; port CAN#2_L
CAN#3_H: U14.4(A) ; port CAN#3_H
CAN#3_L: U15.4(A) ; port CAN#3_L
CAN#4_H: U16.4(A) ; port CAN#4_H
CAN#4_L: U17.4(A) ; port CAN#4_L
EXT_RESET: R109.2 U13.12(IO8) ; port EXT_RESET
MCU_RXD: CON7.1 U13.30(IO0/RXD)
MCU_TXD: CON7.2 U13.31(IO1/TXD)
MISO: CON8.1 U13.16(IO12/MISO)
MODE_SEL#1: R106.2 S5.3 S5.4 U13.23(A0)
MODE_SEL#2: R107.2 S6.3 S6.4 U13.24(A1)
MOSI: CON8.4 U13.15(IO11/MOSI/PWM)
RST: C43.1 CON8.5 R113.2 U13.29(~{RST})
SCK: CON8.3 Q17.1(g) R110.2 R114.2 U13.17(IO13/SCK)
SEL_CAN#3: R115.1 U13.14(IO10/PWM) U14.6(S) U15.6(S)
SEL_CAN#4: R117.1 U13.13(IO9/PWM) U16.6(S) U17.6(S)
XTAL1: C39.2 R105.1 U13.7(XTAL1) Y6.3(OSC2)
XTAL2: C40.2 R105.2 R111.1 Y6.1(OSC1)
NetC41_1: C41.1 U13.20(AREF)
NetCON8_2: CON8.2 R112.1
NetLED17_2: LED17.2(K) R108.2
NetQ1_1: U13.1(IO3/PWM) ; port CAN#2_BUS_SEL#0
NetQ2_1: U13.32(IO2) ; port CAN#1_BUS_SEL#0
NetQ12_1: U13.2(IO4) ; port CAN#3_BUS_SEL#0
NetQ13_1: U13.9(IO5/PWM) ; port CAN#3_BUS_SEL#1
NetQ14_1: U13.10(IO6/PWM) ; port CAN#4_BUS_SEL#0
NetQ15_1: U13.11(IO7) ; port CAN#4_BUS_SEL#1
NetQ17_2: Q17.2(D) R108.1 R110.1
NetR111_2: R111.2 U13.8(XTAL2)

Not connected (* = marked no-connect by the designer): U13 19(A6)* 22(A7)* 25(A2)* 26(A3)* 27(A4)* 28(A5)*

### Notes on the sheet
- Title:
- Project:
- Date:
- Author:
- Board:
- Version:
- Sheet:
- of

### Library data of the parts
C37 C38 C41-C47 = Cap: as C30 on sheet MCUs; ClassName: ModeSelector
C39 C40 = Cap: as C7 on sheet CAN-BUS; ClassName: ModeSelector
CON7 = Header 3: Header, 3-Pin; ClassName: ModeSelector
CON8 = Header 3X2: Header, 3-Pin, Dual row; ClassName: ModeSelector
LED17 = LED: as LED1 on sheet EXTERNAL-INTERFACES; ClassName: ModeSelector
Q17 = Transistor-NMOS(GDS): as Q1 on sheet EXTERNAL-INTERFACES; ClassName: ModeSelector
R105 = Res: Resistor; PartNumber1: RC0603FR-071ML; Manufacturer1: Yageo; ClassName: ModeSelector
R106 R107 R109 R113 R115 R117 = Res: as R130 on sheet USB-UART; ClassName: ModeSelector
R108 = Res: as R42 on sheet EXTERNAL-INTERFACES; ClassName: ModeSelector
R110 = Res: as R45 on sheet EXTERNAL-INTERFACES; ClassName: ModeSelector
R111 R112 = Res: as R121 on sheet USB-UART; ClassName: ModeSelector
R114 = Res: as R38 on sheet EXTERNAL-INTERFACES; ClassName: ModeSelector
U13 = ATMEGA328PB-AU: 8-bit AVR® RISC-based microcontroller (MCU) with picoPower® technology.; PartNumber1: ATMEGA328PB-AUR; Manufacturer1: Microchip; ClassName: ModeSelector
U14-U17 = SN74LVC1G3157DBVR: Single-Pole Double-Throw Analog Switch; Manufacturer1: Texas Instruments; ClassName: ModeSelector; PartNumber1: SN74LVC1G3157DBVR
Y6 = XTAL-4-PIN: PartNumber1: ECS-160-12-33Q-JES-TR; Manufacturer1: ECS; ClassName: ModeSelector
S5 S6 = SPST-NO: ClassName: *; PartNumber1: *; Manufacturer1: *

## Nets that join several sheets
5V: MCUs (12 pins), USB-UART (7 pins), CAN-BUS (25 pins), LIN-BUS (11 pins), EXTERNAL-INTERFACES (25 pins), MODE-SELECTOR (20 pins)
GND: MCUs (16 pins), USB-UART (45 pins), CAN-BUS (51 pins), LIN-BUS (8 pins), EXTERNAL-INTERFACES (46 pins), MODE-SELECTOR (30 pins)
CAN#1_H: CAN-BUS (5 pins), MODE-SELECTOR (U14.3 U16.3)
CAN#1_L: CAN-BUS (5 pins), MODE-SELECTOR (U15.3 U17.3)
CAN#2_H: CAN-BUS (F3.1 R32.2 TZ2.1 U6.7), MODE-SELECTOR (U14.1 U16.1)
CAN#2_~{INT}: MCUs (CON4.5), CAN-BUS (U2.12 U3.12)
CAN#2_L: CAN-BUS (F4.1 R33.2 TZ2.3 U6.6), MODE-SELECTOR (U15.1 U17.1)
CAN#2_SCK: MCUs (CON4.16), CAN-BUS (U2.13 U3.13)
CAN#2_SI: MCUs (CON4.14), CAN-BUS (R17.1 U2.14 U3.14)
CAN#2_SO: MCUs (CON4.15), CAN-BUS (R17.2 U2.15 U3.15)
CAN#3_H: CAN-BUS (U9.7), MODE-SELECTOR (U14.4)
CAN#3_L: CAN-BUS (U9.6), MODE-SELECTOR (U15.4)
CAN#4_H: CAN-BUS (U10.7), MODE-SELECTOR (U16.4)
CAN#4_L: CAN-BUS (U10.6), MODE-SELECTOR (U17.4)
EXT_RESET: MCUs (8 pins), CAN-BUS (5 pins), MODE-SELECTOR (R109.2 U13.12)
MCU_AIN#0: MCUs (CON3.19 CON4.19 CON5.19 CON6.19), EXTERNAL-INTERFACES (R87.2)
MCU_AIN#1: MCUs (CON3.20 CON4.20 CON5.20 CON6.20), EXTERNAL-INTERFACES (R88.2)
MCU_AIN#2: MCUs (CON3.21 CON4.21 CON5.21 CON6.21), EXTERNAL-INTERFACES (R89.2)
MCU_AIN#3: MCUs (CON3.22 CON4.22 CON5.22 CON6.22), EXTERNAL-INTERFACES (R90.2)
MCU_DIN#0: MCUs (CON3.23 CON4.23 CON5.23 CON6.23), EXTERNAL-INTERFACES (R38.1 S1.1 S1.2)
MCU_DIN#1: MCUs (CON3.24 CON4.24 CON5.24 CON6.24), EXTERNAL-INTERFACES (R39.1 S2.1 S2.2)
MCU_DIN#2: MCUs (CON3.12 CON4.12 CON5.12 CON6.12), EXTERNAL-INTERFACES (R40.1 S3.1 S3.2)
MCU_DIN#3: MCUs (CON3.11 CON4.11 CON5.11 CON6.11), EXTERNAL-INTERFACES (R41.1 S4.1 S4.2)
NetC23_1: MCUs (CON4.26), EXTERNAL-INTERFACES (C23.1 R92.2)
NetCON3_1: MCUs (CON3.1), USB-UART (R122.2)
NetCON3_2: MCUs (CON3.2), USB-UART (R121.2)
NetCON3_5: MCUs (CON3.5), CAN-BUS (U1.12)
NetCON3_6: MCUs (CON3.6), EXTERNAL-INTERFACES (Q4.1 R59.2 R75.2)
NetCON3_7: MCUs (CON3.7), EXTERNAL-INTERFACES (Q5.1 R60.2 R76.2)
NetCON3_8: MCUs (CON3.8), EXTERNAL-INTERFACES (R92.1)
NetCON3_9: MCUs (CON3.9), EXTERNAL-INTERFACES (R93.2)
NetCON3_10: MCUs (CON3.10), EXTERNAL-INTERFACES (Q16.1 R94.2)
NetCON3_13: MCUs (CON3.13), CAN-BUS (U1.16)
NetCON3_14: MCUs (CON3.14), CAN-BUS (R7.2 U1.14)
NetCON3_15: MCUs (CON3.15), CAN-BUS (R7.1 U1.15)
NetCON3_16: MCUs (CON3.16), CAN-BUS (U1.13)
NetCON3_25: MCUs (CON3.25), EXTERNAL-INTERFACES (R95.2)
NetCON4_1: MCUs (CON4.1), USB-UART (R125.2)
NetCON4_2: MCUs (CON4.2), USB-UART (R124.2)
NetCON4_6: MCUs (CON4.6), EXTERNAL-INTERFACES (Q6.1 R61.2 R77.2)
NetCON4_7: MCUs (CON4.7), EXTERNAL-INTERFACES (Q7.1 R62.2 R78.2)
NetCON4_9: MCUs (CON4.9), CAN-BUS (U3.16)
NetCON4_13: MCUs (CON4.13), CAN-BUS (U2.16)
NetCON5_1: MCUs (CON5.1), USB-UART (R129.2)
NetCON5_2: MCUs (CON5.2), USB-UART (R128.2)
NetCON5_5: MCUs (CON5.5), CAN-BUS (U7.12)
NetCON5_6: MCUs (CON5.6), EXTERNAL-INTERFACES (Q8.1 R63.2 R79.2)
NetCON5_7: MCUs (CON5.7), EXTERNAL-INTERFACES (Q9.1 R64.2 R80.2)
NetCON5_8: MCUs (CON5.8), LIN-BUS (R100.2)
NetCON5_9: MCUs (CON5.9), LIN-BUS (R96.1 U11.1)
NetCON5_13: MCUs (CON5.13), CAN-BUS (U7.16)
NetCON5_14: MCUs (CON5.14), CAN-BUS (R25.2 U7.14)
NetCON5_15: MCUs (CON5.15), CAN-BUS (R25.1 U7.15)
NetCON5_16: MCUs (CON5.16), CAN-BUS (U7.13)
NetCON6_1: MCUs (CON6.1), USB-UART (R135.2)
NetCON6_2: MCUs (CON6.2), USB-UART (R134.2)
NetCON6_5: MCUs (CON6.5), CAN-BUS (U8.12)
NetCON6_6: MCUs (CON6.6), EXTERNAL-INTERFACES (Q10.1 R65.2 R81.2)
NetCON6_7: MCUs (CON6.7), EXTERNAL-INTERFACES (Q11.1 R66.2 R82.2)
NetCON6_8: MCUs (CON6.8), LIN-BUS (R104.2)
NetCON6_9: MCUs (CON6.9), LIN-BUS (R101.1 U12.1)
NetCON6_13: MCUs (CON6.13), CAN-BUS (U8.16)
NetCON6_14: MCUs (CON6.14), CAN-BUS (R26.2 U8.14)
NetCON6_15: MCUs (CON6.15), CAN-BUS (R26.1 U8.15)
NetCON6_16: MCUs (CON6.16), CAN-BUS (U8.13)
NetQ1_1: EXTERNAL-INTERFACES (6 pins), MODE-SELECTOR (U13.1)
NetQ2_1: EXTERNAL-INTERFACES (Q2.1 R45.2 R48.2), MODE-SELECTOR (U13.32)
NetQ12_1: EXTERNAL-INTERFACES (Q12.1 R71.2 R83.2), MODE-SELECTOR (U13.2)
NetQ13_1: EXTERNAL-INTERFACES (Q13.1 R72.2 R84.2), MODE-SELECTOR (U13.9)
NetQ14_1: EXTERNAL-INTERFACES (Q14.1 R73.2 R85.2), MODE-SELECTOR (U13.10)
NetQ15_1: EXTERNAL-INTERFACES (Q15.1 R74.2 R86.2), MODE-SELECTOR (U13.11)

## Assembly variants
StdAssy: not fitted C72 CON7 CON8 D2 D3 R14 R15 R16 R35 R36 R45 R46 R47 R59 R60 R61 R62 R63 R64 R65 R66 R71 R72 R73 R74 R110 R112 R138 S7 TZ3 U20
BoM_Mouser: not fitted C72 CON1 CON2 CON3 CON4 CON5 CON6 CON7 CON8 D2 D3 JP1 JP2 LED4 LED5 LED6 LED7 LED8 LED9 LED10 LED11 LED16 LS1 R14 R15 R16 R35 R36 R45 R46 R47 R59 R60 R61 R62 R63 R64 R65 R66 R71 R72 R73 R74 R110 R112 R138 S1 S2 S3 S4 S5 S6 S7 TZ3 U20 VR1